# Altium project 6DOF_CONTROLLER.PrjPcb (part 1 of 2)
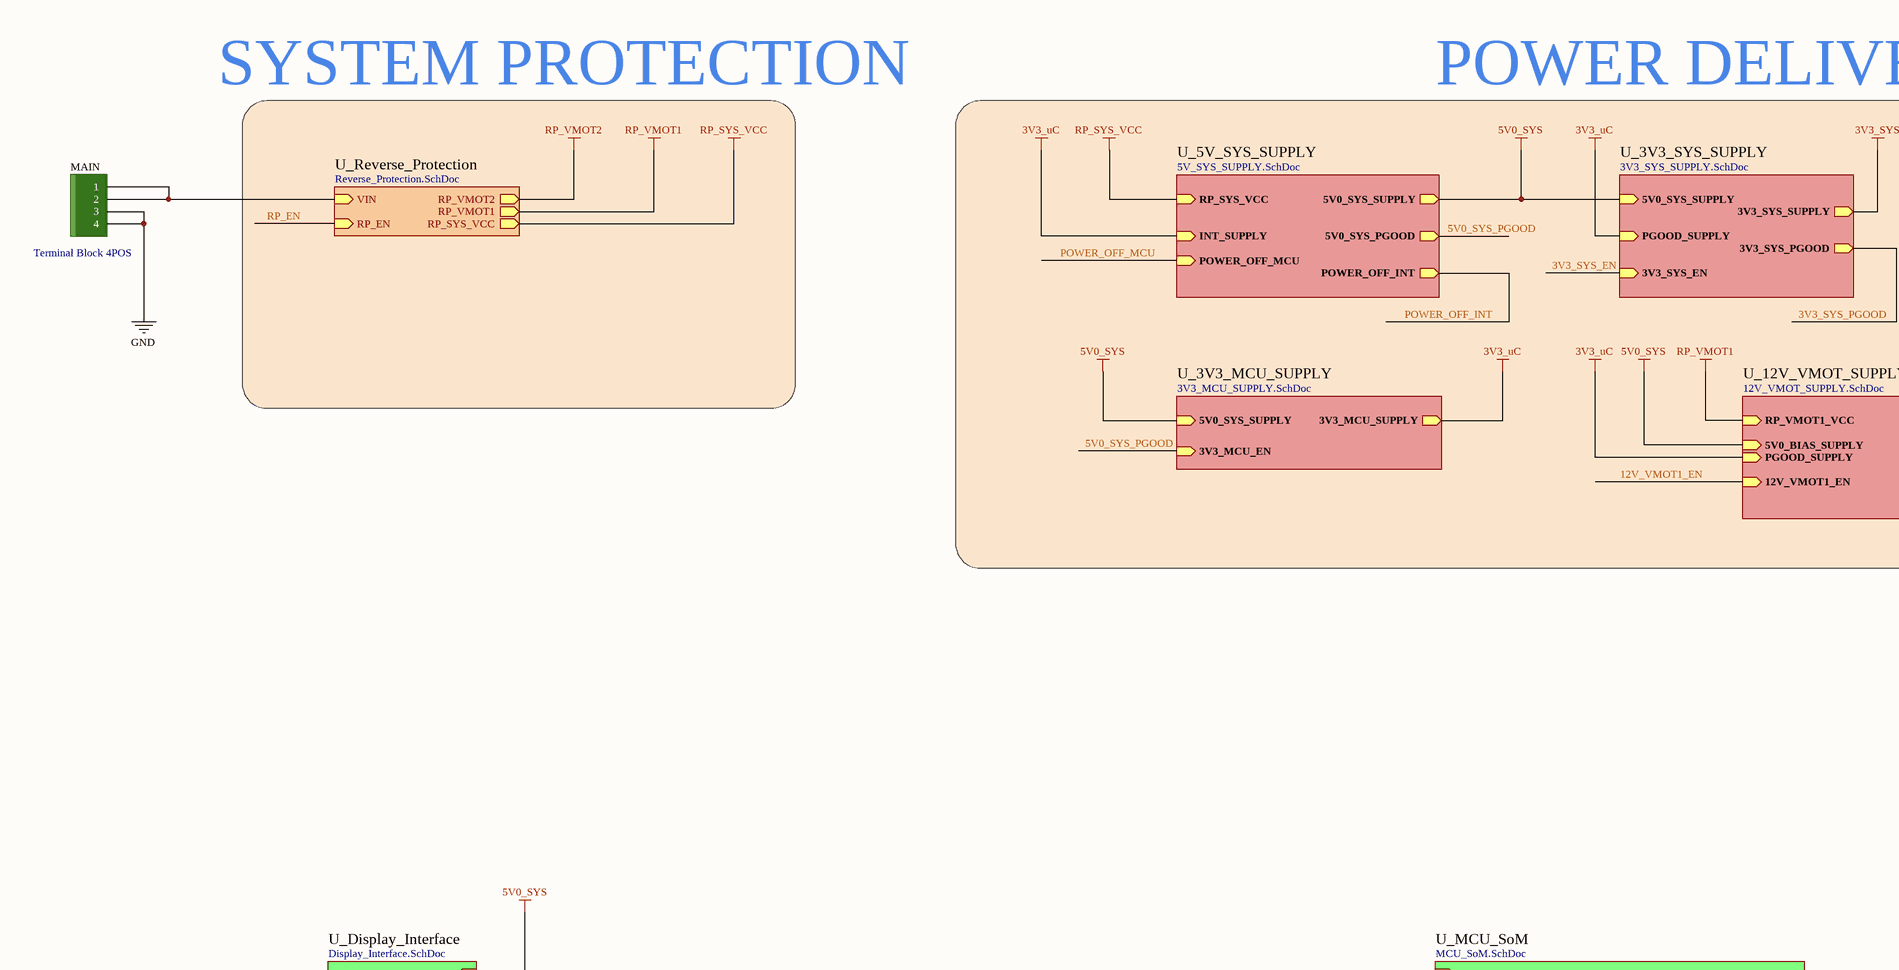
[diagram p0: 6DOF_CONTROLLER_Top.SchDoc, top left]
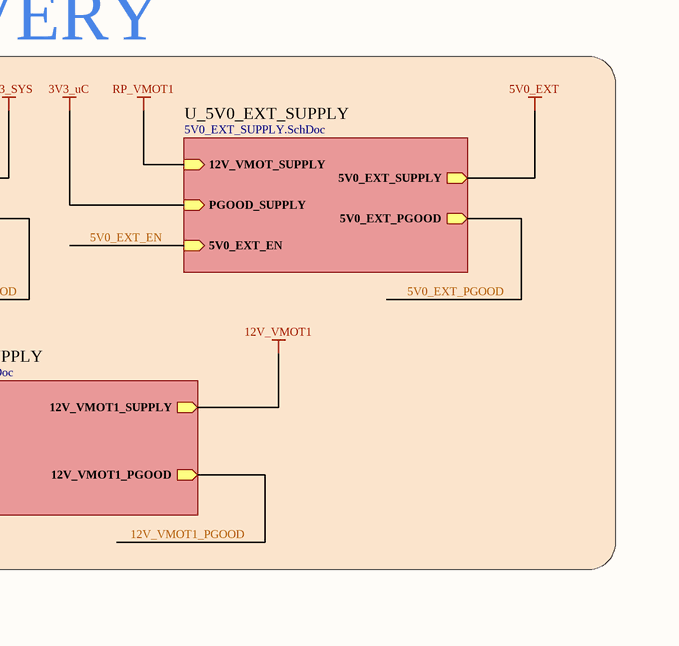
[diagram p1: 6DOF_CONTROLLER_Top.SchDoc, top right]
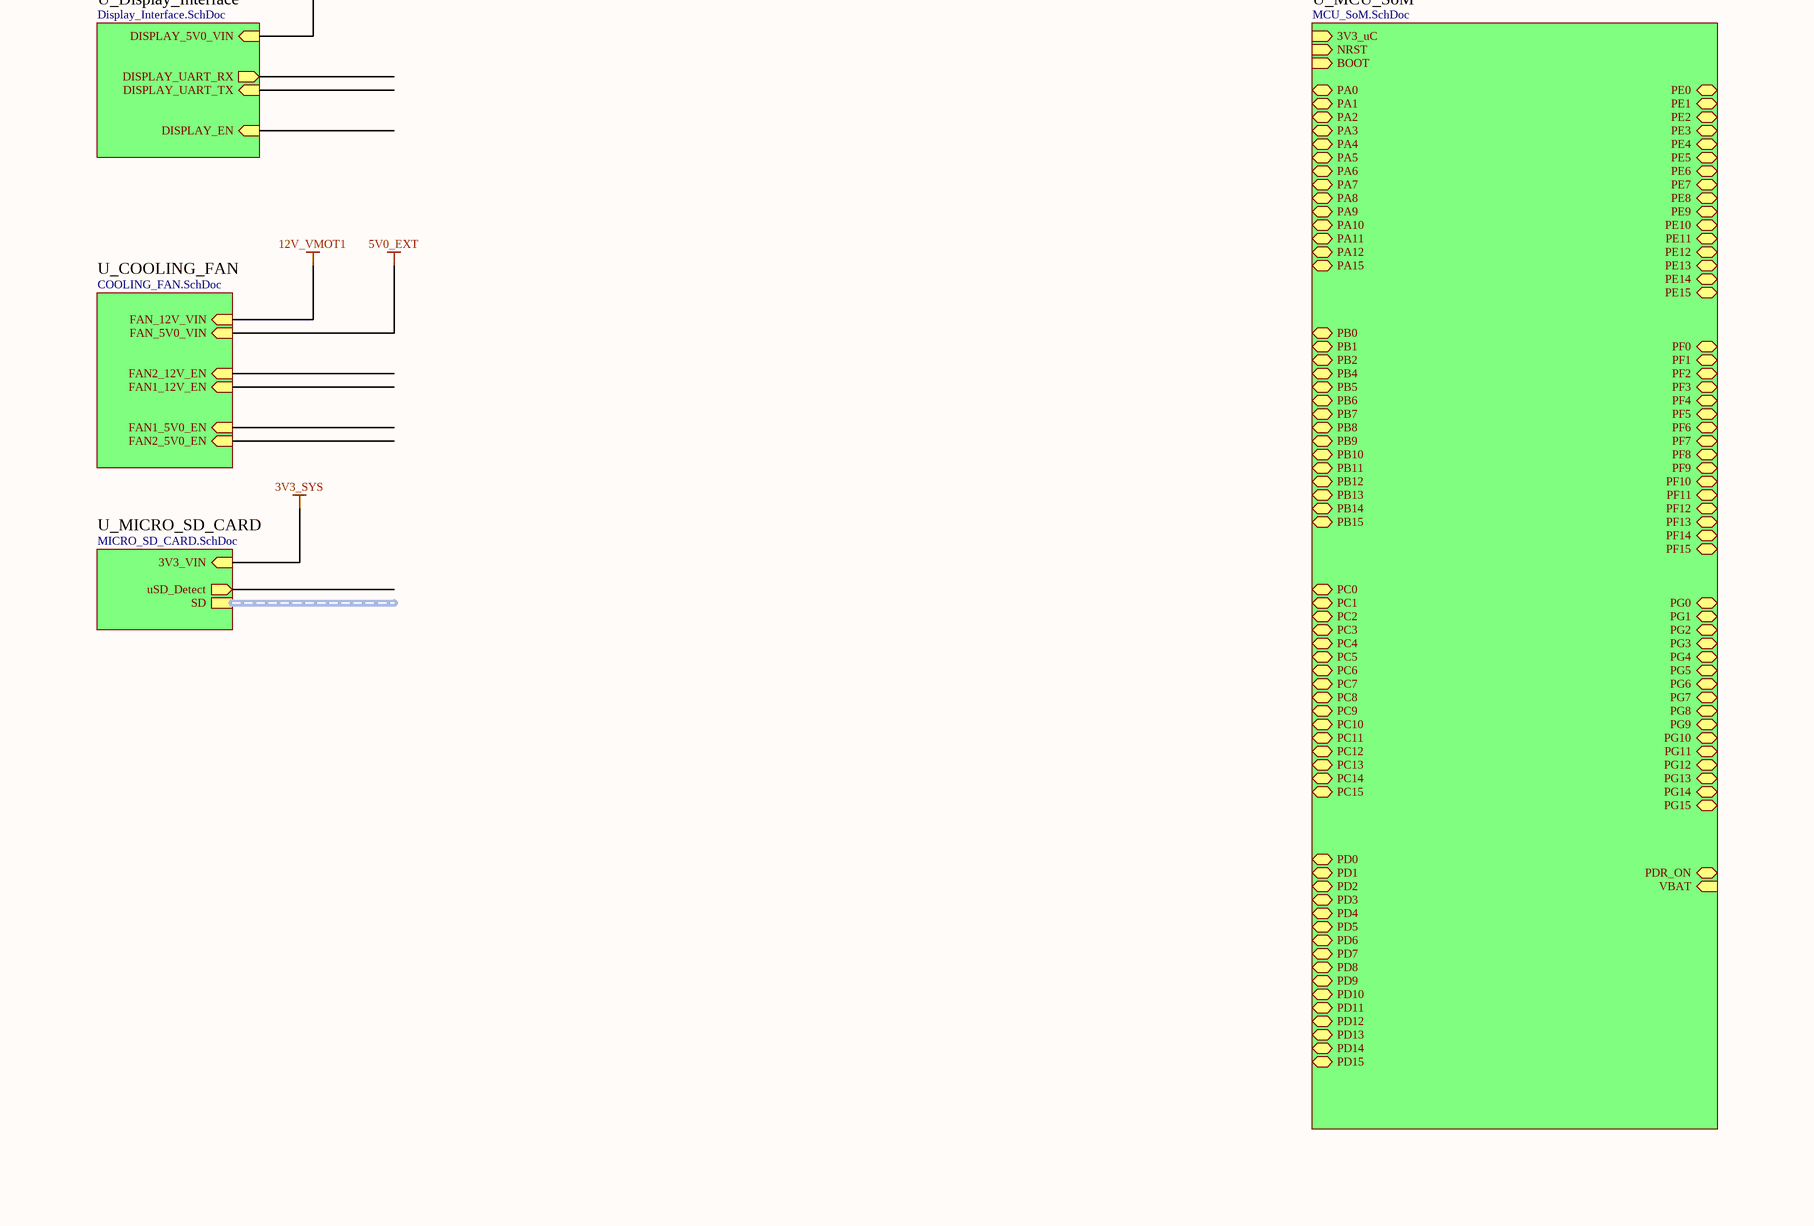
[diagram p2: 6DOF_CONTROLLER_Top.SchDoc, bottom left]
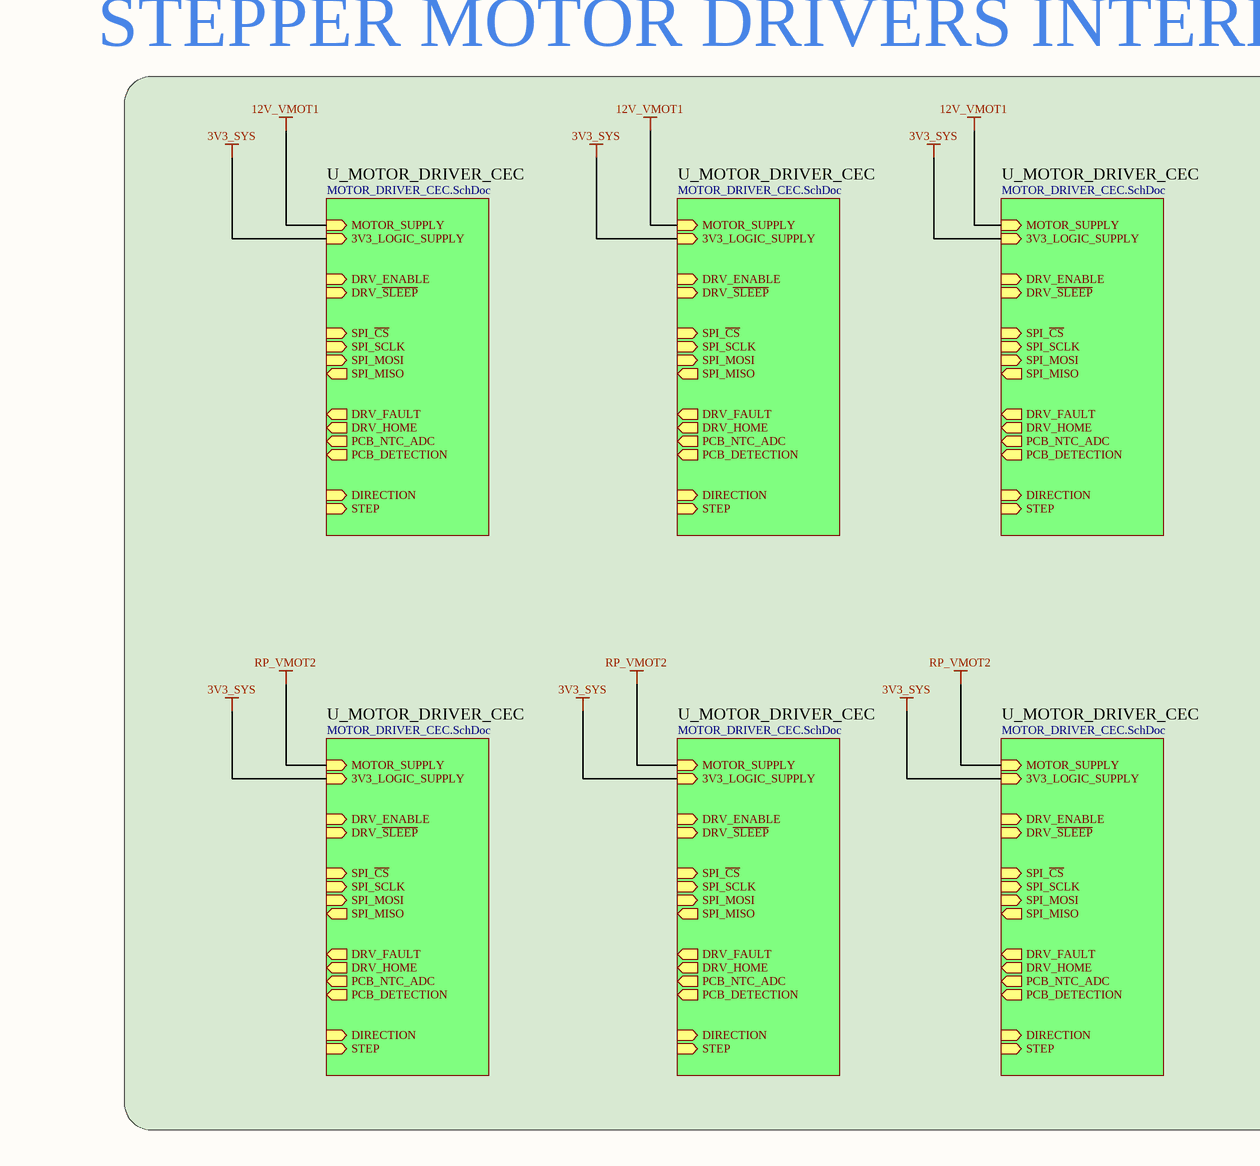
[diagram p3: 6DOF_CONTROLLER_Top.SchDoc, bottom right]
12 sheets, 465 parts. Net scope: hierarchical (ports join the sheet entries above them; power ports are global).
Board file: 6DOF_CONTROLLER.PcbDoc
Sheets:
  6DOF_CONTROLLER_Top.SchDoc
    U_Reverse_Protection = Reverse_Protection.SchDoc
    U_5V_SYS_SUPPLY = 5V_SYS_SUPPLY.SchDoc
    U_3V3_SYS_SUPPLY = 3V3_SYS_SUPPLY.SchDoc
    U_5V0_EXT_SUPPLY = 5V0_EXT_SUPPLY.SchDoc
    U_3V3_MCU_SUPPLY = 3V3_MCU_SUPPLY.SchDoc
    U_MOTOR_DRIVER_CEC = MOTOR_DRIVER_CEC.SchDoc
    U_MOTOR_DRIVER_CEC = MOTOR_DRIVER_CEC.SchDoc
    U_MOTOR_DRIVER_CEC = MOTOR_DRIVER_CEC.SchDoc
    U_MOTOR_DRIVER_CEC = MOTOR_DRIVER_CEC.SchDoc
    U_MOTOR_DRIVER_CEC = MOTOR_DRIVER_CEC.SchDoc
    U_MOTOR_DRIVER_CEC = MOTOR_DRIVER_CEC.SchDoc
    U_12V_VMOT_SUPPLY = 12V_VMOT_SUPPLY.SchDoc
    U_COOLING_FAN = COOLING_FAN.SchDoc
    U_Display_Interface = Display_Interface.SchDoc
    U_MICRO_SD_CARD = MICRO_SD_CARD.SchDoc
    U_MCU_SoM = MCU_SoM.SchDoc

## Sheet 6DOF_CONTROLLER_Top.SchDoc
size A1; SheetNumber: 1; SheetTotal: 12

### Parts
MAIN  Terminal Block 4POS  [TERM_BLOCK_5.08mm 4PIN]

### Sub-sheets
U_3V3_MCU_SUPPLY = 3V3_MCU_SUPPLY.SchDoc: 3V3_MCU_SUPPLY (out), 3V3_MCU_EN (in), 5V0_SYS_SUPPLY (in)
U_3V3_SYS_SUPPLY = 3V3_SYS_SUPPLY.SchDoc: 3V3_SYS_PGOOD (out), 3V3_SYS_EN (in), 5V0_SYS_SUPPLY (in), 3V3_SYS_SUPPLY (out), PGOOD_SUPPLY (in)
U_5V0_EXT_SUPPLY = 5V0_EXT_SUPPLY.SchDoc: 5V0_EXT_PGOOD (out), 5V0_EXT_EN (in), 12V_VMOT_SUPPLY (in), 5V0_EXT_SUPPLY (out), PGOOD_SUPPLY (in)
U_5V_SYS_SUPPLY = 5V_SYS_SUPPLY.SchDoc: 5V0_SYS_SUPPLY (out), 5V0_SYS_PGOOD (out), RP_SYS_VCC (in), POWER_OFF_INT (out), POWER_OFF_MCU (in), INT_SUPPLY (in)
U_12V_VMOT_SUPPLY = 12V_VMOT_SUPPLY.SchDoc: RP_VMOT1_VCC (in), PGOOD_SUPPLY (in), 12V_VMOT1_PGOOD (out), 5V0_BIAS_SUPPLY (in), 12V_VMOT1_EN (in), 12V_VMOT1_SUPPLY (out)
U_COOLING_FAN = COOLING_FAN.SchDoc: FAN_12V_VIN (in), FAN1_12V_EN (in), FAN2_12V_EN (in), FAN_5V0_VIN (in), FAN1_5V0_EN (in), FAN2_5V0_EN (in)
U_Display_Interface = Display_Interface.SchDoc: DISPLAY_5V0_VIN (in), DISPLAY_EN (in), DISPLAY_UART_TX (in), DISPLAY_UART_RX (out)
U_MCU_SoM = MCU_SoM.SchDoc: 3V3_uC (in), NRST (in), PE2 (bidir), PE3 (bidir), PE4 (bidir), PE5 (bidir), PE6 (bidir), PC13 (bidir), PC14 (bidir), PC15 (bidir), PC0 (bidir), PC1 (bidir), PC2 (bidir), PC3 (bidir), PC4 (bidir), PC5 (bidir), PB0 (bidir), PB1 (bidir), PB2 (bidir), PF11 (bidir), PF12 (bidir), PF13 (bidir), PF14 (bidir), PF15 (bidir), PB10 (bidir), PB11 (bidir), PE15 (bidir), VBAT (in), PF0 (bidir), PF1 (bidir), PF2 (bidir), PF3 (bidir), PF4 (bidir), PF5 (bidir), PF6 (bidir), PF7 (bidir), PF8 (bidir), PF9 (bidir), PF10 (bidir), PA0 (bidir), PA1 (bidir), PA2 (bidir), PA3 (bidir), PA4 (bidir), PA5 (bidir), PA6 (bidir), PA7 (bidir), PG0 (bidir), PG1 (bidir), PE7 (bidir), PE8 (bidir), PE9 (bidir), PE10 (bidir), PE11 (bidir), PE12 (bidir), PE13 (bidir), PE14 (bidir), PE1 (bidir), PE0 (bidir), PB9 (bidir), PB8 (bidir), BOOT (in), PB7 (bidir), PB6 (bidir), PB5 (bidir), PB4 (bidir), PC12 (bidir), PC11 (bidir), PC10 (bidir), PA15 (bidir), PA12 (bidir), PA11 (bidir), PA10 (bidir), PA9 (bidir), PA8 (bidir), PC9 (bidir), PC8 (bidir), PC7 (bidir), PC6 (bidir), PG8 (bidir), PG7 (bidir), PG6 (bidir), PG5 (bidir), PG4 (bidir), PG3 (bidir), PG2 (bidir), PDR_ON (bidir), PG15 (bidir), PG14 (bidir), PG13 (bidir), PG12 (bidir), PG11 (bidir), PG10 (bidir), PG9 (bidir), PD7 (bidir), PD6 (bidir), PD5 (bidir), PD4 (bidir), PD3 (bidir), PD2 (bidir), PD1 (bidir), PD0 (bidir), PD15 (bidir), PD14 (bidir), PD13 (bidir), PD12 (bidir), PD11 (bidir), PD10 (bidir), PD9 (bidir), PD8 (bidir), PB15 (bidir), PB14 (bidir), PB13 (bidir), PB12 (bidir)
U_MICRO_SD_CARD = MICRO_SD_CARD.SchDoc: SD (harness SD), 3V3_VIN (in), uSD_Detect (out)
U_MOTOR_DRIVER_CEC = MOTOR_DRIVER_CEC.SchDoc: SPI_~{CS} (in), SPI_MISO (out), SPI_MOSI (in), SPI_SCLK (in), DRV_ENABLE (in), DRV_~{SLEEP} (in), MOTOR_SUPPLY (in), 3V3_LOGIC_SUPPLY (in), STEP (in), DRV_FAULT (out), DRV_HOME (out), DIRECTION (in), PCB_NTC_ADC (out), PCB_DETECTION (out)
U_MOTOR_DRIVER_CEC = MOTOR_DRIVER_CEC.SchDoc: SPI_~{CS} (in), SPI_MISO (out), SPI_MOSI (in), SPI_SCLK (in), DRV_ENABLE (in), DRV_~{SLEEP} (in), MOTOR_SUPPLY (in), 3V3_LOGIC_SUPPLY (in), STEP (in), DRV_FAULT (out), DRV_HOME (out), DIRECTION (in), PCB_NTC_ADC (out), PCB_DETECTION (out)
U_MOTOR_DRIVER_CEC = MOTOR_DRIVER_CEC.SchDoc: SPI_~{CS} (in), SPI_MISO (out), SPI_MOSI (in), SPI_SCLK (in), DRV_ENABLE (in), DRV_~{SLEEP} (in), MOTOR_SUPPLY (in), 3V3_LOGIC_SUPPLY (in), STEP (in), DRV_FAULT (out), DRV_HOME (out), DIRECTION (in), PCB_NTC_ADC (out), PCB_DETECTION (out)
U_MOTOR_DRIVER_CEC = MOTOR_DRIVER_CEC.SchDoc: SPI_~{CS} (in), SPI_MISO (out), SPI_MOSI (in), SPI_SCLK (in), DRV_ENABLE (in), DRV_~{SLEEP} (in), MOTOR_SUPPLY (in), 3V3_LOGIC_SUPPLY (in), STEP (in), DRV_FAULT (out), DRV_HOME (out), DIRECTION (in), PCB_NTC_ADC (out), PCB_DETECTION (out)
U_MOTOR_DRIVER_CEC = MOTOR_DRIVER_CEC.SchDoc: SPI_~{CS} (in), SPI_MISO (out), SPI_MOSI (in), SPI_SCLK (in), DRV_ENABLE (in), DRV_~{SLEEP} (in), MOTOR_SUPPLY (in), 3V3_LOGIC_SUPPLY (in), STEP (in), DRV_FAULT (out), DRV_HOME (out), DIRECTION (in), PCB_NTC_ADC (out), PCB_DETECTION (out)
U_MOTOR_DRIVER_CEC = MOTOR_DRIVER_CEC.SchDoc: SPI_~{CS} (in), SPI_MISO (out), SPI_MOSI (in), SPI_SCLK (in), DRV_ENABLE (in), DRV_~{SLEEP} (in), MOTOR_SUPPLY (in), 3V3_LOGIC_SUPPLY (in), STEP (in), DRV_FAULT (out), DRV_HOME (out), DIRECTION (in), PCB_NTC_ADC (out), PCB_DETECTION (out)
U_Reverse_Protection = Reverse_Protection.SchDoc: VIN (in), RP_VMOT2 (out), RP_VMOT1 (out), RP_SYS_VCC (out), RP_EN (in)

### Nets
3V3_SYS: sheet U_3V3_SYS_SUPPLY/3V3_SYS_SUPPLY, sheet U_MOTOR_DRIVER_CEC/3V3_LOGIC_SUPPLY, sheet U_MOTOR_DRIVER_CEC/3V3_LOGIC_SUPPLY, sheet U_MOTOR_DRIVER_CEC/3V3_LOGIC_SUPPLY, sheet U_MOTOR_DRIVER_CEC/3V3_LOGIC_SUPPLY, sheet U_MOTOR_DRIVER_CEC/3V3_LOGIC_SUPPLY, sheet U_MOTOR_DRIVER_CEC/3V3_LOGIC_SUPPLY, sheet U_MICRO_SD_CARD/3V3_VIN
3V3_uC: sheet U_5V_SYS_SUPPLY/INT_SUPPLY, sheet U_3V3_SYS_SUPPLY/PGOOD_SUPPLY, sheet U_5V0_EXT_SUPPLY/PGOOD_SUPPLY, sheet U_3V3_MCU_SUPPLY/3V3_MCU_SUPPLY, sheet U_12V_VMOT_SUPPLY/PGOOD_SUPPLY
5V0_EXT: sheet U_5V0_EXT_SUPPLY/5V0_EXT_SUPPLY, sheet U_COOLING_FAN/FAN_5V0_VIN
5V0_SYS: sheet U_5V_SYS_SUPPLY/5V0_SYS_SUPPLY, sheet U_3V3_SYS_SUPPLY/5V0_SYS_SUPPLY, sheet U_3V3_MCU_SUPPLY/5V0_SYS_SUPPLY, sheet U_12V_VMOT_SUPPLY/5V0_BIAS_SUPPLY, sheet U_Display_Interface/DISPLAY_5V0_VIN
12V_VMOT1: sheet U_MOTOR_DRIVER_CEC/MOTOR_SUPPLY, sheet U_MOTOR_DRIVER_CEC/MOTOR_SUPPLY, sheet U_MOTOR_DRIVER_CEC/MOTOR_SUPPLY, sheet U_12V_VMOT_SUPPLY/12V_VMOT1_SUPPLY, sheet U_COOLING_FAN/FAN_12V_VIN
GND: MAIN.3 MAIN.4
RP_SYS_VCC: sheet U_Reverse_Protection/RP_SYS_VCC, sheet U_5V_SYS_SUPPLY/RP_SYS_VCC
RP_VMOT1: sheet U_Reverse_Protection/RP_VMOT1, sheet U_5V0_EXT_SUPPLY/12V_VMOT_SUPPLY, sheet U_12V_VMOT_SUPPLY/RP_VMOT1_VCC
RP_VMOT2: sheet U_Reverse_Protection/RP_VMOT2, sheet U_MOTOR_DRIVER_CEC/MOTOR_SUPPLY, sheet U_MOTOR_DRIVER_CEC/MOTOR_SUPPLY, sheet U_MOTOR_DRIVER_CEC/MOTOR_SUPPLY
5V0_SYS_PGOOD: sheet U_5V_SYS_SUPPLY/5V0_SYS_PGOOD, sheet U_3V3_MCU_SUPPLY/3V3_MCU_EN
NetC2000_2: MAIN.1 MAIN.2 ; sheet U_Reverse_Protection/VIN

### Notes on the sheet
- SYSTEM PROTECTION
- POWER DELIVERY
- STEPPER MOTOR DRIVERS INTERFACE

### Library data of the parts
MAIN = 00000011: XY2500R-D 250V 12A 5.08mm; ComponentLink1Description: Mikroprinc; ComponentLink1URL: https://www.mikroprinc.com/sr/proizvod/konektor-za-klemu-4-pol-pod-uglom-90-print-rm-508-xy2500

## Sheet Reverse_Protection.SchDoc
size A4; SheetNumber: 2; SheetTotal: 12
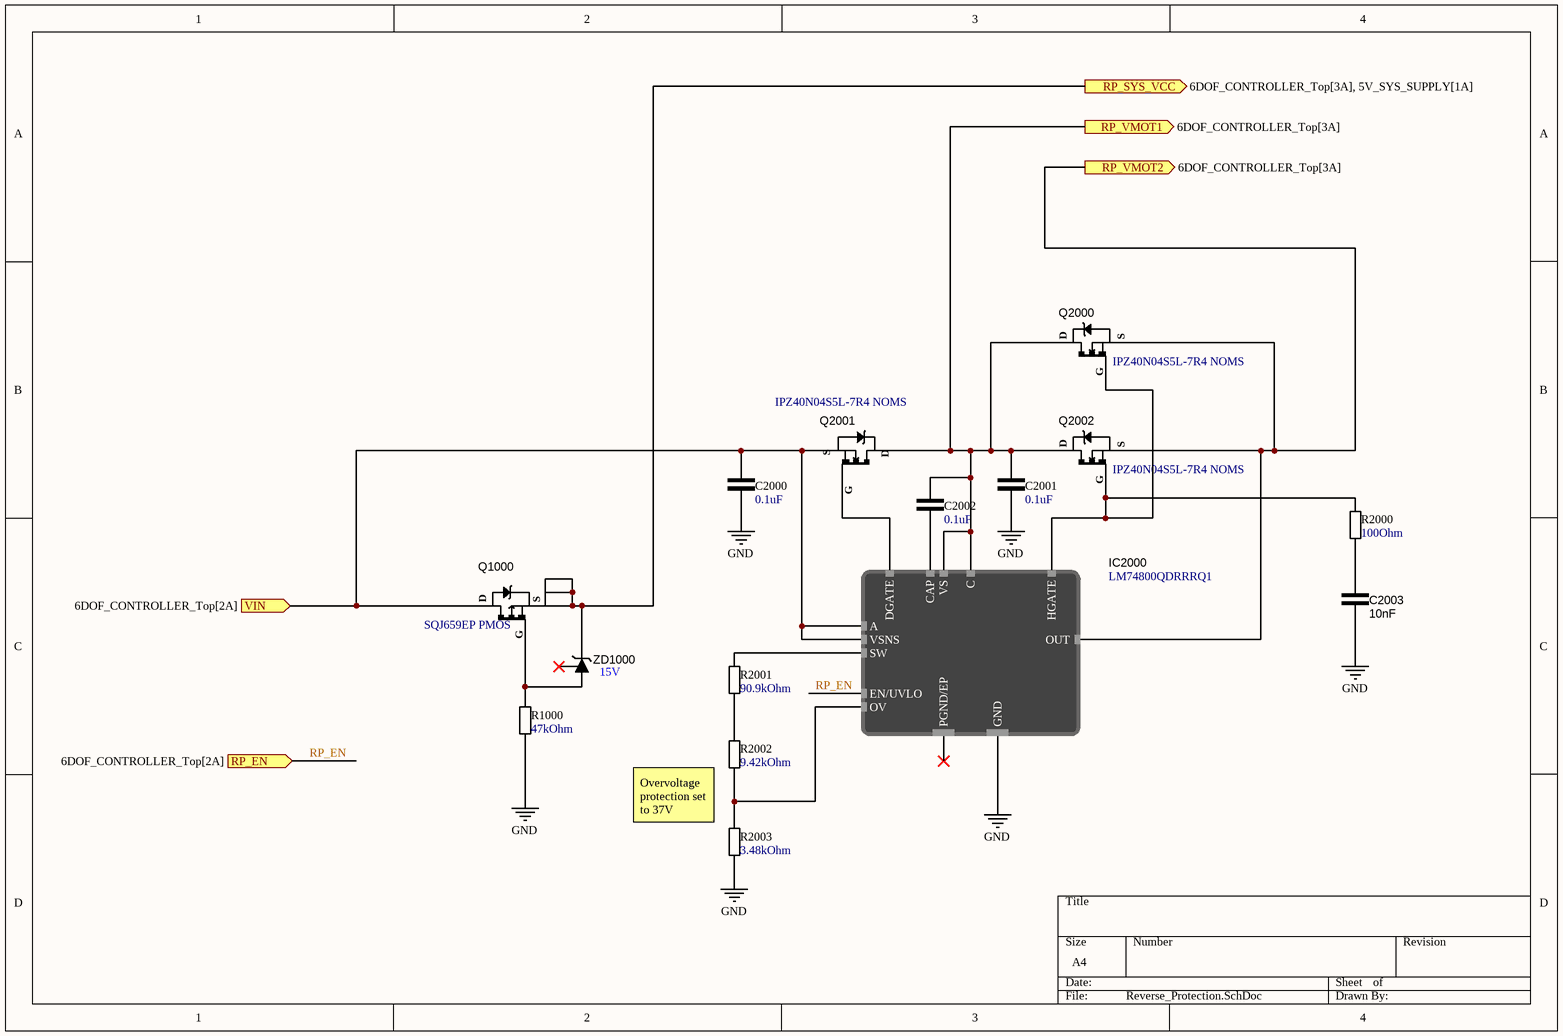
[diagram p4: Reverse_Protection.SchDoc]

### Parts
C2000  0.1uF  [CAP_0603]
C2001  0.1uF  [CAP_0603]
C2002  0.1uF  [CAP_0603]
C2003  10nF  [CAP_0603]
IC2000  LM74800QDRRRQ1  [SON50P300X80_HS-13N]
Q1000  SQJ659EP PMOS  [PowerPAK SO-8L SINGLE]
Q2000  IPZ40N04S5L-7R4 NOMS  [PG-TSDSON-8-32]
Q2001  IPZ40N04S5L-7R4 NOMS  [PG-TSDSON-8-32]
Q2002  IPZ40N04S5L-7R4 NOMS  [PG-TSDSON-8-32]
R1000  47kOhm  [RES_0603]
R2000  100Ohm  [RES_0603]
R2001  90.9kOhm  [RES_0603]
R2002  9.42kOhm  [RES_0603]
R2003  3.48kOhm  [RES_0603]
ZD1000  DZ23C15-E3-08 Zener Diode  [SOT95P245X96-3N]  (value not drawn)

### Ports
RP_EN (in, see 6DOF_CONTROLLER_Top[2A]), RP_SYS_VCC (out, see 6DOF_CONTROLLER_Top[3A], 5V_SYS_SUPPLY[1A]), RP_VMOT1 (out, see 6DOF_CONTROLLER_Top[3A]), RP_VMOT2 (out, see 6DOF_CONTROLLER_Top[3A]), VIN (in, see 6DOF_CONTROLLER_Top[2A])

### Nets
GND: C2000.1 C2001.1 C2003.1 IC2000.7(GND) R1000.1 R2003.1
RP_SYS_VCC: Q1000.S(S1) ZD1000.3(Cathode) ; port RP_SYS_VCC
RP_VMOT1: C2001.2 C2002.2 IC2000.10(VS) IC2000.12(C) Q2000.D(Drain) Q2001.D(Drain) Q2002.D(Drain) ; port RP_VMOT1
RP_VMOT2: IC2000.9(OUT) Q2000.S(Source) Q2002.S(Source) ; port RP_VMOT2
RP_EN: IC2000.6(EN/UVLO) ; port RP_EN
NetC2000_2: C2000.2 IC2000.2(A) IC2000.3(VSNS) Q1000.D Q2001.S(Source) ; port VIN
NetC2002_1: C2002.1 IC2000.11(CAP)
NetC2003_2: C2003.2 R2000.1
NetIC2000_1: IC2000.1(DGATE) Q2001.G(Gate)
NetIC2000_4: IC2000.4(SW) R2001.2
NetIC2000_5: IC2000.5(OV) R2002.1 R2003.2
NetIC2000_8: IC2000.8(HGATE) Q2000.G(Gate) Q2002.G(Gate) R2000.2
NetQ1000_G: Q1000.G R1000.2 ZD1000.1(Anode)
NetR2001_1: R2001.1 R2002.2

Not connected (* = marked no-connect by the designer): IC2000 13(PGND/EP)*; ZD1000 2(Anode)*

### Notes on the sheet
- (near ZD1000) 15V
- Overvoltage protection set to 37V

### Library data of the parts
C2000-C2002 = C000018: 0.1 µF ±10% 50V Ceramic Capacitor X7R 0603 (1608 Metric); ComponentLink1Description: DigiKey; ComponentLink1URL: https://www.digikey.com/en/products/detail/samsung-electro-mechanics/CL10B104KB8NNNC/3886658; DigiKey Part Number: 1276-1000-1-ND; capacitance: 0.1uF
C2003 = C000034: 10000 pF ±10% 50V Ceramic Capacitor X7R 0603 (1608 Metric); ComponentLink1Description: DigiKey; ComponentLink1URL: https://www.digikey.com/en/products/detail/kemet/C0603C103K5RACTU/411090; DigiKey Part Number: 399-C0603C103K5RACTUCT-ND; capacitance: 10nF
IC2000 = LM74800QDRRRQ1: OR Controller N+1 ORing Controller N-Channel 1:1 12-WSON (3x3); DigiKey Part Number: 296-LM74800QDRRRQ1CT-ND; ComponentLink1Description: DigiKey; ComponentLink1URL: https://www.digikey.com/en/products/detail/texas-instruments/LM74800QDRRRQ1/13627158; Mouser Part Number: 595-LM74800QDRRRQ1; ComponentLink2Description: Mouser; ComponentLink2URL: https://eu.mouser.com/ProductDetail/Texas-Instruments/LM74800QDRRRQ1?qs=KUoIvG%2F9IlYNgS7D9vQjYA%3D%3D
Q1000 = 00000005: P-Channel 60 V 52A (Tc) 83W (Tc) Surface Mount PowerPAK® SO-8; DigiKey Part Number: SQJ459EP-T1_GE3CT-ND; Mouser Part Number: 78-SQJ459EP-T2_BE3; ComponentLink1Description: DigiKey; ComponentLink1URL: https://www.digikey.com/en/products/detail/vishay-siliconix/SQJ459EP-T1-GE3/6708881; ComponentLink2Description: Mouser; ComponentLink2URL: https://eu.mouser.com/ProductDetail/Vishay-Siliconix/SQJ459EP-T2_BE3?qs=CiayqK2gdcKpg8h0vLRPjA%3D%3D
Q2000-Q2002 = 00000007: N-Channel 40 V 40A (Tc) 34W (Tc) Surface Mount PG-TSDSON-8; DigiKey Part Number: IPZ40N04S5L7R4ATMA1CT-ND; Mouser Part Number: 726-IPZ40N04S5L7R4AT; ComponentLink1Description: DigiKey; ComponentLink1URL: https://www.digikey.com/en/products/detail/infineon-technologies/IPZ40N04S5L7R4ATMA1/5960382; ComponentLink2Description: Mouser; ComponentLink2URL: https://eu.mouser.com/ProductDetail/Infineon-Technologies/IPZ40N04S5L7R4ATMA1?qs=RJIhqtkBntMJfptUOROQRQ%3D%3D; ComponentLink3Description: Footprint Drawing; ComponentLink3URL: https://www.infineon.com/cms/en/product/packages/PG-TSDSON/PG-TSDSON-8-32/#!downloads
R1000 = R000010: 47 kOhms ±1% 0.1W, 1/10W Chip Resistor 0603 (1608 Metric) Moisture Resistant Thick Film; ComponentLink1Description: DigiKey; ComponentLink1URL: https://www.digikey.com/en/products/detail/yageo/RC0603FR-0747KL/727253; resistance: 47kOhm; DigiKey Part Number: 311-47.0KHRCT-ND
R2000 = R000030: 100 Ohms ±1% 0.1W, 1/10W Chip Resistor 0603 (1608 Metric) Moisture Resistant Thick Film; ComponentLink1Description: DigiKey; ComponentLink1URL: https://www.digikey.com/en/products/detail/yageo/RC0603FR-07100RL/726888; resistance: 100Ohm; DigiKey Part Number: 311-100HRCT-ND
R2001 = R000027: 90.9 kOhms ±1% 0.1W, 1/10W Chip Resistor 0603 (1608 Metric) Automotive AEC-Q200 Thick Film; ComponentLink1Description: DigiKey; ComponentLink1URL: https://www.digikey.com/en/products/detail/panasonic-electronic-components/ERJ-3EKF9092V/196512; resistance: 90.9kOhm; DigiKey Part Number: P90.9KHCT-ND
R2002 = R000028: 9.42 kOhms ±1% 0.1W, 1/10W Chip Resistor 0603 (1608 Metric) Automotive AEC-Q200, Moisture Resistant Metal Film; ComponentLink1Description: DigiKey; ComponentLink1URL: https://www.digikey.com/en/products/detail/koa-speer-electronics-inc/RN73H1JTTD9421F25/10688584?s=N4IgjCBcoMxaBjKAzAhgGwM4FMA0IB7KAbXDBggF18AHAFyhAGU6AnASwDsBzEAX3xgAbPBBJIaLHkIkQMAJwAmACwjqIeoxYce-fIoAMADgCso8ZJz4ikUvIB0yxQAIA1gHkAFgFtMIdZqQIACqnOx07sgAstiomACurNh6IAC0iuZQbPHSNqRmlHwCIBm2IEmY7Jh0BKz%2BfEA; resistance: 9.42kOhm; DigiKey Part Number: 2019-RN73H1JTTD9421F25CT-ND
R2003 = R000029: 3.48 kOhms ±1% 0.1W, 1/10W Chip Resistor 0603 (1608 Metric) Automotive AEC-Q200 Thick Film; ComponentLink1Description: DigiKey; ComponentLink1URL: https://www.digikey.com/en/products/detail/stackpole-electronics-inc/RMCF0603FT3K48/1761028; resistance: 3.48kOhm; DigiKey Part Number: RMCF0603FT3K48CT-ND
ZD1000 = 00000006: Zener Diode Array 1 Pair Common Cathode 15 V 300 mW ±5% SOT-23-3; DigiKey Part Number: 112-DZ23C15-E3-08CT-ND; ComponentLink1Description: DigiKey; ComponentLink1URL: https://www.digikey.com/en/products/detail/vishay-general-semiconductor-diodes-division/DZ23C15-E3-08/4831460

## Sheet 5V_SYS_SUPPLY.SchDoc
size A3; SheetNumber: 3; SheetTotal: 12
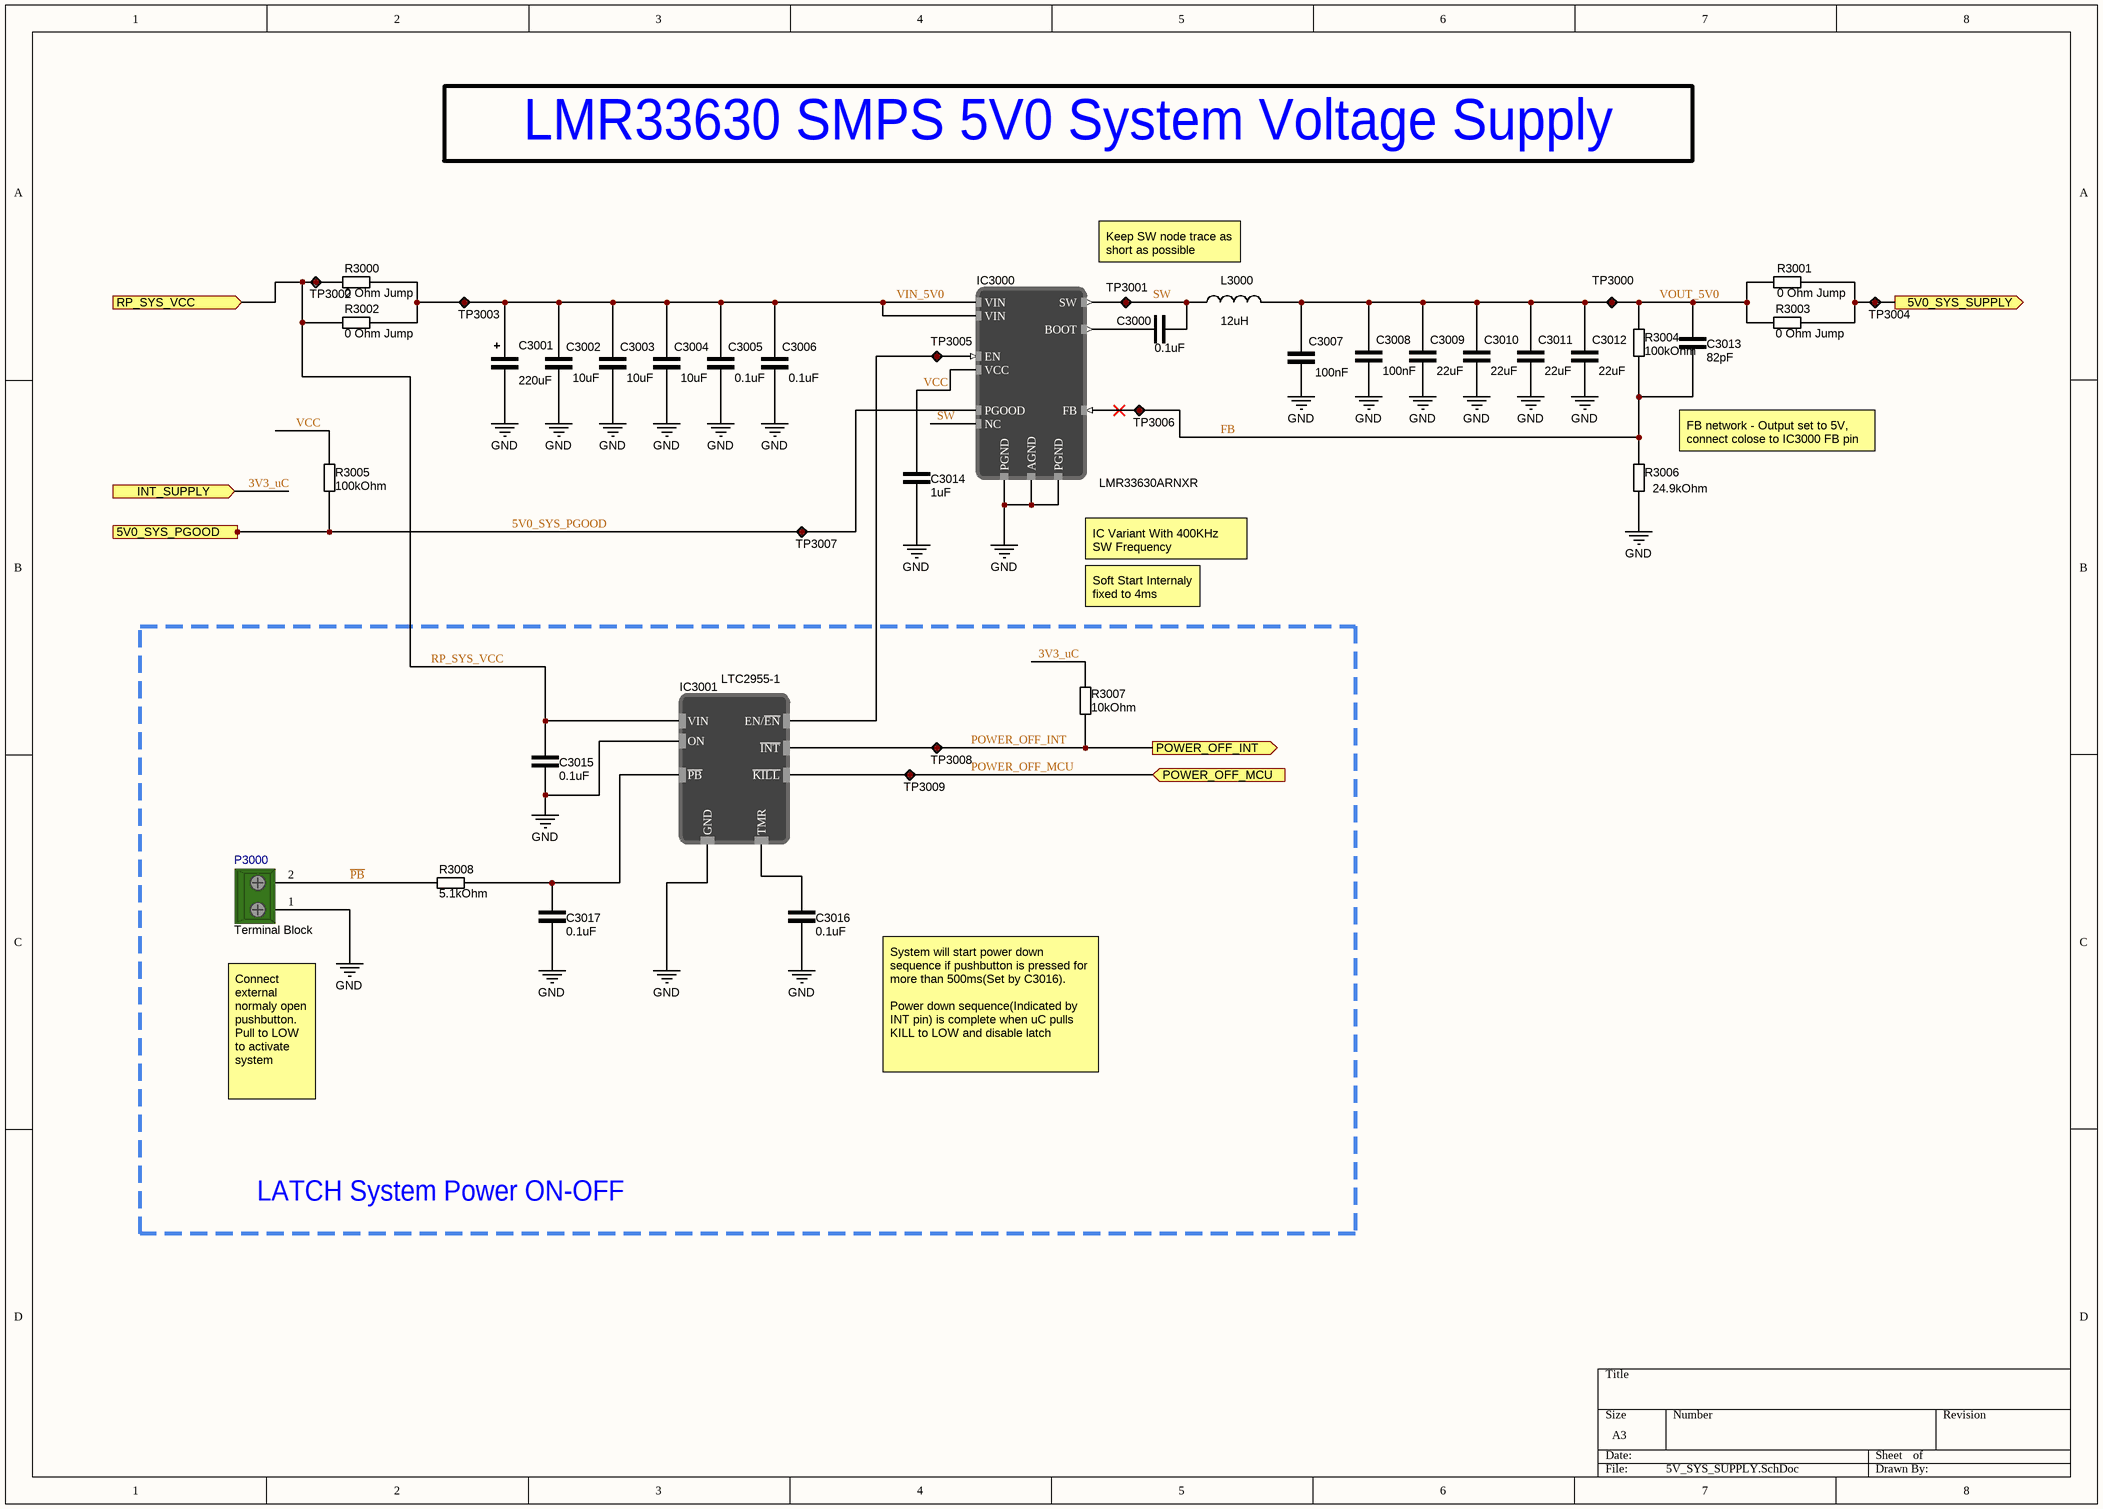
[diagram p5: 5V_SYS_SUPPLY.SchDoc]

### Parts
C3000  0.1uF  [CAP_0603]
C3001  220uF  [CAPAE109103X103M]
C3002  10uF  [CAP_1206]
C3003  10uF  [CAP_1206]
C3004  10uF  [CAP_1206]
C3005  0.1uF  [CAP_0603]
C3006  0.1uF  [CAP_0603]
C3007  100nF  [CAP_0603]
C3008  100nF  [CAP_0603]
C3009  22uF  [CAP_1206]
C3010  22uF  [CAP_1206]
C3011  22uF  [CAP_1206]
C3012  22uF  [CAP_1206]
C3013  82pF  [CAP_0603]
C3014  1uF  [CAP_0603]
C3015  0.1uF  [CAP_0603]
C3016  0.1uF  [CAP_0603]
C3017  0.1uF  [CAP_0603]
IC3000  LMR33630ARNXR  [VQFN-HR]
IC3001  LTC2955-1  [TSOP65P280X100-8N]
L3000  12uH  [INDM120120X80N]
P3000  Terminal Block  [TERM_BLOCK 5mm 2PIN]
R3000  0 Ohm Jump  [RES_0805]
R3001  0 Ohm Jump  [RES_1206]
R3002  0 Ohm Jump  [RES_0805]
R3003  0 Ohm Jump  [RES_1206]
R3004  100kOhm  [RES_0603]
R3005  100kOhm  [RES_0603]
R3006  24.9kOhm  [RES_0603]
R3007  10kOhm  [RES_0603]
R3008  5.1kOhm  [RES_0603]
TP3000  Test point  [TestPoint]  (value not drawn)
TP3001  Test point  [TestPoint]  (value not drawn)
TP3002  Test point  [TestPoint]  (value not drawn)
TP3003  Test point  [TestPoint]  (value not drawn)
TP3004  Test point  [TestPoint]  (value not drawn)
TP3005  Test point  [TestPoint]  (value not drawn)
TP3006  Test point  [TestPoint]  (value not drawn)
TP3007  Test point  [TestPoint]  (value not drawn)
TP3008  Test point  [TestPoint]  (value not drawn)
TP3009  Test point  [TestPoint]  (value not drawn)

### Ports
5V0_SYS_PGOOD (out, see 6DOF_CONTROLLER_Top[5A]), 5V0_SYS_SUPPLY (out, see 6DOF_CONTROLLER_Top[5A], 3V3_MCU_SUPPLY[1B], 3V3_SYS_SUPPLY[1B]), INT_SUPPLY (in, see 6DOF_CONTROLLER_Top[5A]), POWER_OFF_INT (out, see 6DOF_CONTROLLER_Top[5A]), POWER_OFF_MCU (in, see 6DOF_CONTROLLER_Top[5A]), RP_SYS_VCC (in, see 6DOF_CONTROLLER_Top[5A], Reverse_Protection[3A])

### Nets
3V3_uC: R3007.2 ; port INT_SUPPLY
5V0_SYS: R3001.1 R3003.2 TP3004.1 ; port 5V0_SYS_SUPPLY
GND: C3001.1 C3002.1 C3003.1 C3004.1 C3005.1 C3006.1 C3008.1 C3009.1 C3010.1 C3011.1 C3012.1 C3014.1 C3015.1 C3016.1 C3017.1 IC3000.1(PGND) IC3000.6(AGND) IC3000.11(PGND) IC3001.1(ON) IC3001.4(GND) P3000.1(pin1) R3006.1
RP_SYS_VCC: C3015.2 IC3001.6(VIN) R3000.1 R3002.1 TP3002.1 ; port RP_SYS_VCC
5V0_SYS_PGOOD: IC3000.8(PGOOD) R3005.1 TP3007.1 ; port 5V0_SYS_PGOOD
FB: C3013.1 IC3000.7(FB) R3004.1 R3006.2 TP3006.1  [project net FB_3]
~{PB}: P3000.2(pin2) R3008.1  [project net ~{PB}_3]
POWER_OFF_INT: IC3001.8(~{INT}) R3007.1 TP3008.1 ; port POWER_OFF_INT
POWER_OFF_MCU: IC3001.2(~{KILL}) TP3009.1 ; port POWER_OFF_MCU
SW: C3000.2 IC3000.3(NC) IC3000.12(SW) L3000.1 TP3001.1  [project net SW_3]
VCC: C3014.2 IC3000.5(VCC) R3005.2  [project net VCC_3]
VIN_5V0: C3001.2 C3002.2 C3003.2 C3004.2 C3005.2 C3006.2 IC3000.2(VIN) IC3000.10(VIN) R3000.2 R3002.2 TP3003.1  [project net VIN_5V0_3]
VOUT_5V0: C3007.2 C3008.2 C3009.2 C3010.2 C3011.2 C3012.2 C3013.2 L3000.2 R3001.2 R3003.1 R3004.2 TP3000.1  [project net VOUT_5V0_3]
NetC3000_1: C3000.1 IC3000.4(BOOT)
NetC3016_2: C3016.2 IC3001.3(TMR)
NetC3017_2: C3017.2 IC3001.5(~{PB}) R3008.2
NetIC3000_9: IC3000.9(EN) IC3001.7(EN/~{EN}) TP3005.1

Not connected (* = marked no-connect by the designer): C3007 1

### Notes on the sheet
- LMR33630 SMPS 5V0 System Voltage Supply
- Keep SW node trace as short as possible
- FB network - Output set to 5V, connect colose to IC3000 FB pin
- (near IC3000) IC Variant With 400KHz SW Frequency
- Soft Start Internaly fixed to 4ms
- Connect external normaly open pushbutton.
  Pull to LOW to activate system
- System will start power down sequence if pushbutton is pressed for more than 500ms(Set by C3016).
  Power down sequence(Indicated by INT pin) is complete when uC pulls KILL to LOW and disable latch
- LATCH System Power ON-OFF
- Labels drawn without touching a wire or pin: GND

### Library data of the parts
C3000 C3005 C3006 C3015-C3017 = C000018: as C2000 on sheet Reverse_Protection; ComponentLink1Description: DigiKey; ComponentLink1URL: https://www.digikey.com/en/products/detail/samsung-electro-mechanics/CL10B104KB8NNNC/3886658; DigiKey Part Number: 1276-1000-1-ND; capacitance: 0.1uF
C3001 = C000019: 220 µF 50 V Aluminum Electrolytic Capacitors Radial, Can - SMD 7000 Hrs @ 105°C; ComponentLink1Description: DigiKey; ComponentLink1URL: https://www.digikey.com/en/products/detail/nichicon/UCW1H221MNL1GS/2549783; DigiKey Part Number: 493-9426-1-ND; capacitance: 220uF
C3002-C3004 = C000017: 10 µF ±10% 50V Ceramic Capacitor X7R 1206 (3216 Metric); ComponentLink1Description: DigiKey; ComponentLink1URL: https://www.digikey.com/en/products/detail/samsung-electro-mechanics/CL31B106KBHNNNE/5961251; DigiKey Part Number: 1276-6767-1-ND; capacitance: 10uF
C3007 C3008 = C000007: 0.1 µF ±10% 25V Ceramic Capacitor X7R 0603 (1608 Metric); ComponentLink1Description: DigiKey; ComponentLink1URL: https://www.digikey.com/en/products/detail/kyocera-avx/06033C104K4T2A/8019250; DigiKey Part Number: 478-KAM15AR71E104KTCT-ND; capacitance: 100nF
C3009-C3012 = C000020: 22 µF ±10% 25V Ceramic Capacitor X5R 1206 (3216 Metric); ComponentLink1Description: DigiKey; ComponentLink1URL: https://www.digikey.com/en/products/detail/samsung-electro-mechanics/CL31A226KAHNNNE/3888705; DigiKey Part Number: 1276-3047-1-ND; capacitance: 22uF
C3013 = C000021: 82 pF ±1% 25V Ceramic Capacitor C0G, NP0 0603 (1608 Metric); ComponentLink1Description: DigiKey; ComponentLink1URL: https://www.digikey.com/en/products/detail/kyocera-avx/KGM15ACG1E820FT/1599315?s=N4IgjCBcoMxaBjKAzAhgGwM4FMA0IB7KAbXDBggF18AHAFyhAGU6AnASwDsBzEAX3xgALPBBJIaLHkIlwAVgCcAJiEB2ENRD1GLDj36CAbKPGSc%2BIpFIxlQ45u2RmbLrwEglABiEKTKDOYyViAAHEoABDQAYhq0DE4AqpzsdADyyACy2KiYAK6s2AYgALRKfpBsudKWpHIafA1AA; DigiKey Part Number: 478-KGM15ACG1E820FTCT-ND; capacitance: 82pF
C3014 = C000011: 1 µF ±10% 10V Ceramic Capacitor X7R 0603 (1608 Metric); ComponentLink1Description: DigiKey; ComponentLink1URL: https://www.digikey.com/en/products/detail/samsung-electro-mechanics/CL10B105KP8NNNC/3887604; DigiKey Part Number: 1276-1946-2-ND; capacitance: 1uF
IC3000 = LMR33630ARNXR: Buck Switching Regulator IC Positive Adjustable 1V 1 Output 3A 12-VFQFN; DigiKey Part Number: 296-49764-1-ND; ComponentLink1Description: DigiKey; ComponentLink1URL: https://www.digikey.com/en/products/detail/texas-instruments/LMR33630ARNXR/9356577; Mouser Part Number: 595-LMR33630ARNXR; ComponentLink2Description: Mouser; ComponentLink2URL: https://eu.mouser.com/ProductDetail/Texas-Instruments/LMR33630ARNXR?qs=55YtniHzbhBobt6bGtLStw%3D%3D
IC3001 = LTC2955-1: Power Supply Controller Push Button, On/Off Controller TSOT-23-8; DigiKey Part Number: 505-LTC2955CTS8-1#TRMPBFCT-ND; ComponentLink1Description: DigiKey; ComponentLink1URL: https://www.digikey.com/en/products/detail/analog-devices-inc/LTC2955CTS8-1-TRMPBF/3065178; Mouser Part Number: 584-C2955CTS8-1TMPF; ComponentLink2Description: Mouser; ComponentLink2URL: https://eu.mouser.com/ProductDetail/Analog-Devices/LTC2955CTS8-1TRMPBF?qs=hVkxg5c3xu%252B6Fq1Ir3bkGg%3D%3D
L3000 = L000007: FIXED IND 12UH 5.9A 24 MOHM SMD; inductance: 12uH; DigiKey Part Number: 732-1224-1-ND; ComponentLink1Description: DigiKey; ComponentLink1URL: https://www.digikey.com/en/products/detail/w%C3%BCrth-elektronik/744770112/1638629
P3000 = 00000001: Terminal block 90 deg 5mm 2PIN; ComponentLink1Description: DigiKey; ComponentLink1URL: https://www.digikey.com/en/products/detail/adam-tech/EB20-02-C/9831508; DigiKey part number: 2057-EB20-02-C-ND
R3000 R3002 = R000011: 0 Ohms Jumper Chip Resistor 0805 (2012 Metric) Automotive AEC-Q200 Thick Film; ComponentLink1Description: DigiKey; ComponentLink1URL: https://www.digikey.com/en/products/detail/panasonic-electronic-components/ERJ-6GEY0R00V/78163; resistance: 0 Ohm Jump; DigiKey Part Number: P0.0ACT-ND
R3001 R3003 = R000012: 0 Ohms Jumper Chip Resistor 1206 (3216 Metric) Automotive AEC-Q200 Thick Film; ComponentLink1Description: DigiKey; ComponentLink1URL: https://www.digikey.com/en/products/detail/stackpole-electronics-inc/RMCF1206ZT0R00/1756906; resistance: 0 Ohm Jump; DigiKey Part Number: RMCF1206ZT0R00CT-ND
R3004 R3005 = R000006: 100 kOhms ±1% 0.1W, 1/10W Chip Resistor 0603 (1608 Metric) Automotive AEC-Q200 Thick Film; resistance: 100kOhm; ComponentLink1Description: DigiKey; ComponentLink1URL: https://www.digikey.com/en/products/detail/stackpole-electronics-inc/RMCF0603FG100K/1713543; DigiKey Part Number: RMCF0603FG100KCT-ND
R3006 = R000017: 24.9 kOhms ±1% 0.1W, 1/10W Chip Resistor 0603 (1608 Metric) Automotive AEC-Q200 Thick Film; ComponentLink1Description: DigiKey; ComponentLink1URL: https://www.digikey.com/en/products/detail/panasonic-electronic-components/ERJ-3EKF2492V/196236; resistance: 24.9kOhm; DigiKey Part Number: P24.9KHCT-ND
R3007 = R000001: 10 kOhms ±1% 0.125W, 1/8W Chip Resistor 0603 (1608 Metric) Anti-Sulfur Thin Film; resistance: 10kOhm; ComponentLink1Description: DigiKey; ComponentLink1URL: https://www.digikey.com/en/products/detail/vishay-beyschlag-draloric-bc-components/MCT06030C1002FP500/1850440; DigiKey Part Number: MCT0603-10.0K-CFCT-ND
R3008 = R000013: 5.1 kOhms ±1% 0.1W, 1/10W Chip Resistor 0603 (1608 Metric) Moisture Resistant Thick Film; ComponentLink1Description: DigiKey; ComponentLink1URL: https://www.digikey.com/en/products/detail/yageo/RC0603FR-075K1L/727268; resistance: 5.1kOhm; DigiKey Part Number: 311-5.10KHRCT-ND
TP3000-TP3009 = TP002: Test point 1mm

## Sheet 3V3_SYS_SUPPLY.SchDoc
size A4; SheetNumber: 4; SheetTotal: 12
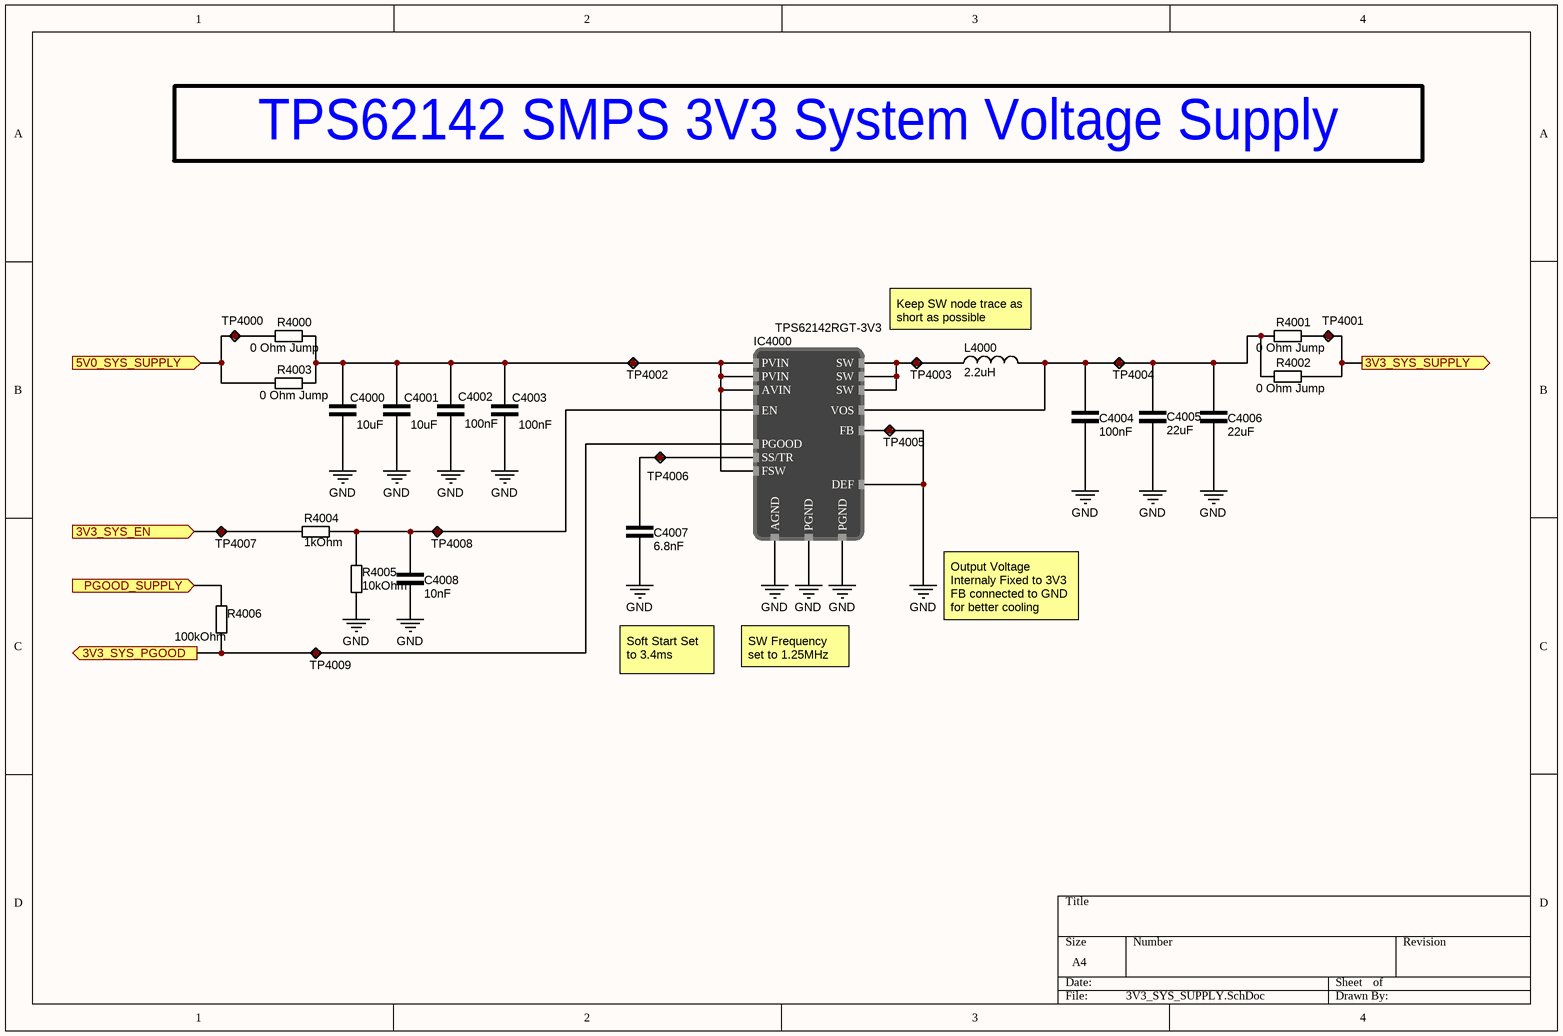
[diagram p6: 3V3_SYS_SUPPLY.SchDoc]

### Parts
C4000  10uF  [CAP_0805]
C4001  10uF  [CAP_0805]
C4002  100nF  [CAP_0603]
C4003  100nF  [CAP_0603]
C4004  100nF  [CAP_0603]
C4005  22uF  [CAP_0805]
C4006  22uF  [CAP_0805]
C4007  6.8nF  [CAP_0603]
C4008  10nF  [CAP_0603]
IC4000  TPS62142RGT-3V3  [QFN50P300X300X100_HS-17N]
L4000  2.2uH  [INDM4441X20N]
R4000  0 Ohm Jump  [RES_0805]
R4001  0 Ohm Jump  [RES_0805]
R4002  0 Ohm Jump  [RES_0805]
R4003  0 Ohm Jump  [RES_0805]
R4004  1kOhm  [RES_0603]
R4005  10kOhm  [RES_0603]
R4006  100kOhm  [RES_0603]
TP4000  Test point  [TestPoint]  (value not drawn)
TP4001  Test point  [TestPoint]  (value not drawn)
TP4002  Test point  [TestPoint]  (value not drawn)
TP4003  Test point  [TestPoint]  (value not drawn)
TP4004  Test point  [TestPoint]  (value not drawn)
TP4005  Test point  [TestPoint]  (value not drawn)
TP4006  Test point  [TestPoint]  (value not drawn)
TP4007  Test point  [TestPoint]  (value not drawn)
TP4008  Test point  [TestPoint]  (value not drawn)
TP4009  Test point  [TestPoint]  (value not drawn)

### Ports
3V3_SYS_EN (in, see 6DOF_CONTROLLER_Top[6A]), 3V3_SYS_PGOOD (out, see 6DOF_CONTROLLER_Top[7A]), 3V3_SYS_SUPPLY (out, see 6DOF_CONTROLLER_Top[7A]), 5V0_SYS_SUPPLY (in, see 6DOF_CONTROLLER_Top[6A], 3V3_MCU_SUPPLY[1B], 5V_SYS_SUPPLY[8A]), PGOOD_SUPPLY (in, see 6DOF_CONTROLLER_Top[6A], 5V0_EXT_SUPPLY[1C], 12V_VMOT_SUPPLY[6C])

### Nets
3V3_SYS: R4001.2 R4002.2 TP4001.1 ; port 3V3_SYS_SUPPLY
3V3_uC: R4006.2 ; port PGOOD_SUPPLY
5V0_SYS: R4000.1 R4003.1 TP4000.1 ; port 5V0_SYS_SUPPLY
GND: C4000.1 C4001.1 C4002.2 C4003.1 C4004.1 C4005.1 C4006.2 C4007.1 C4008.1 IC4000.5(FB) IC4000.6(AGND) IC4000.8(DEF) IC4000.15(PGND) IC4000.16(PGND) R4005.1 TP4005.1
3V3_SYS_EN: R4004.1 TP4007.1 ; port 3V3_SYS_EN
3V3_SYS_PGOOD: IC4000.4(PGOOD) R4006.1 TP4009.1 ; port 3V3_SYS_PGOOD
NetC4000_2: C4000.2 C4001.2 C4002.1 C4003.2 IC4000.7(FSW) IC4000.10(AVIN) IC4000.11(PVIN) IC4000.12(PVIN) R4000.2 R4003.2 TP4002.1
NetC4004_2: C4004.2 C4005.2 C4006.1 IC4000.14(VOS) L4000.2 R4001.1 R4002.1 TP4004.1
NetC4007_2: C4007.2 IC4000.9(SS/TR) TP4006.1
NetC4008_2: C4008.2 IC4000.13(EN) R4004.2 R4005.2 TP4008.1
NetIC4000_1: IC4000.1(SW) IC4000.2(SW) IC4000.3(SW) L4000.1 TP4003.1

### Notes on the sheet
- TPS62142 SMPS 3V3 System Voltage Supply
- Keep SW node trace as short as possible
- Output Voltage Internaly Fixed to 3V3
  FB connected to GND for better cooling
- Soft Start Set to 3.4ms
- SW Frequency set to 1.25MHz

### Library data of the parts
C4000 C4001 = C000002: 10 µF ±10% 25V Ceramic Capacitor X5R 0805 (2012 Metric); ComponentLink1Description: DigiKey; ComponentLink1URL: https://www.digikey.com/en/products/detail/tdk-corporation/C2012X5R1E106K125AB/2443462; DigiKey Part Number: 445-5984-1-ND; capacitance: 10uF
C4002-C4004 = C000007: as C3007 on sheet 5V_SYS_SUPPLY; ComponentLink1Description: DigiKey; ComponentLink1URL: https://www.digikey.com/en/products/detail/kyocera-avx/06033C104K4T2A/8019250; DigiKey Part Number: 478-KAM15AR71E104KTCT-ND; capacitance: 100nF
C4005 C4006 = C000001: 22 µF ±20% 25V Ceramic Capacitor X5R 0805 (2012 Metric); ComponentLink1Description: DigiKey; ComponentLink1URL: https://www.digikey.com/en/products/detail/tdk-corporation/C2012X5R1E226M125AC/3661564; DigiKey Part Number: 445-9112-1-ND; capacitance: 22uF
C4007 = C000023: 6800 pF ±10% 25V Ceramic Capacitor X7R 0603 (1608 Metric); ComponentLink1Description: DigiKey; ComponentLink1URL: https://www.digikey.com/en/products/detail/yageo/CC0603KRX7R8BB682/5883791; DigiKey Part Number: 311-4090-1-ND; capacitance: 6.8nF
C4008 = C000005: 10000 pF ±20% 25V Ceramic Capacitor X7R 0603 (1608 Metric); ComponentLink1Description: DigiKey; ComponentLink1URL: https://www.digikey.com/en/products/detail/kyocera-avx/06033C103MAT2A/1599370; DigiKey Part Number: 478-KGM15AR71E103MTCT-ND; capacitance: 10nF
IC4000 = TPS62142RGT: Buck Switching Regulator IC Positive Fixed 3.3V 1 Output 2A 16-VFQFN Exposed Pad; DigiKey Part Number: 296-29940-1-ND; Mouser Part Number: 595-TPS62142RGTT; ComponentLink1Description: DigiKey; ComponentLink1URL: https://www.digikey.com/en/products/detail/texas-instruments/TPS62142RGTT/2786730; ComponentLink2Description: Mouser; ComponentLink2URL: https://eu.mouser.com/ProductDetail/Texas-Instruments/TPS62142RGTT?qs=gXEV9p%2FxLgdBrEoz0pTJSA%3D%3D
L4000 = L000008: FIXED IND 2.2UH 4A 61 MOHM SMD; inductance: 2.2uH; DigiKey Part Number: SRP4020TA-2R2MCT-ND; ComponentLink1Description: DigiKey; ComponentLink1URL: https://www.digikey.com/en/products/detail/bourns-inc/SRP4020TA-2R2M/4901004?s=N4IgTCBcDaIMoCUAKAWADGNAVAggWjATAFkQBdAXyA
R4000-R4003 = R000011: as R3000 on sheet 5V_SYS_SUPPLY; ComponentLink1Description: DigiKey; ComponentLink1URL: https://www.digikey.com/en/products/detail/panasonic-electronic-components/ERJ-6GEY0R00V/78163; resistance: 0 Ohm Jump; DigiKey Part Number: P0.0ACT-ND
R4004 = R000004: 1 kOhms ±1% 0.125W, 1/8W Chip Resistor 0603 (1608 Metric) Anti-Sulfur Thin Film; resistance: 1kOhm; ComponentLink1Description: DigiKey; ComponentLink1URL: https://www.digikey.com/en/products/detail/vishay-beyschlag-draloric-bc-components/MCT06030C1001FP500/2607821; DigiKey Part Number: MCT0603-1.00K-CFCT-ND
R4005 = R000001: as R3007 on sheet 5V_SYS_SUPPLY; resistance: 10kOhm; ComponentLink1Description: DigiKey; ComponentLink1URL: https://www.digikey.com/en/products/detail/vishay-beyschlag-draloric-bc-components/MCT06030C1002FP500/1850440; DigiKey Part Number: MCT0603-10.0K-CFCT-ND
R4006 = R000006: as R3004 on sheet 5V_SYS_SUPPLY; resistance: 100kOhm; ComponentLink1Description: DigiKey; ComponentLink1URL: https://www.digikey.com/en/products/detail/stackpole-electronics-inc/RMCF0603FG100K/1713543; DigiKey Part Number: RMCF0603FG100KCT-ND
TP4000-TP4009 = TP002: Test point 1mm

## Sheet 5V0_EXT_SUPPLY.SchDoc
size A4; SheetNumber: 5; SheetTotal: 12
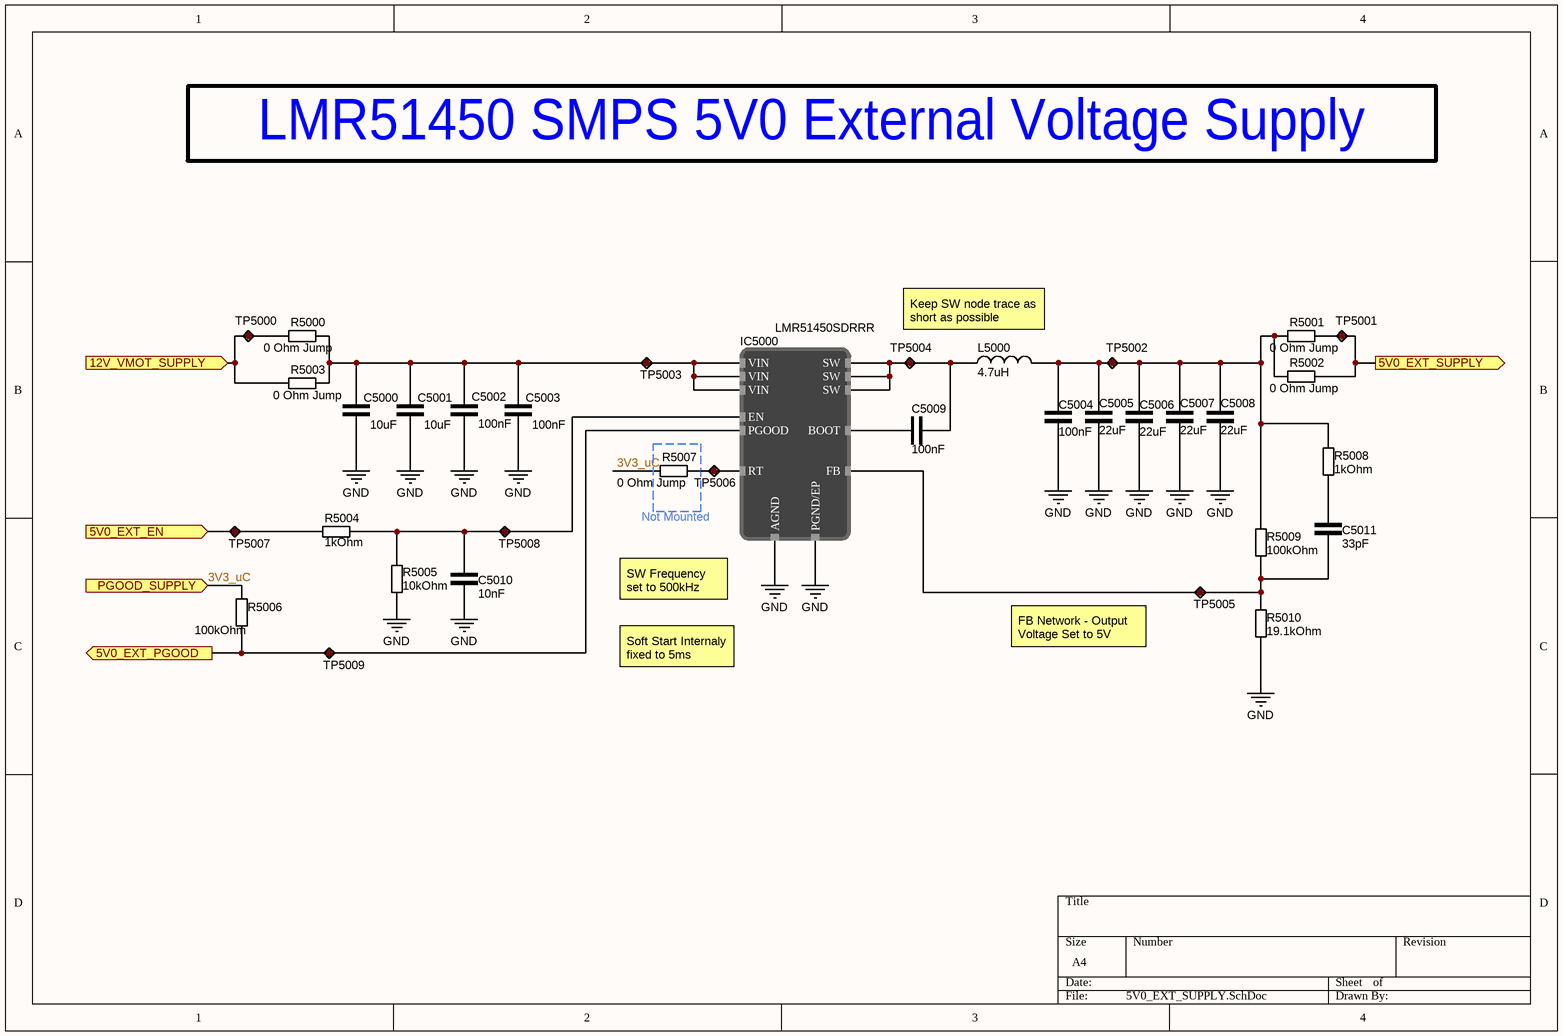
[diagram p7: 5V0_EXT_SUPPLY.SchDoc]

### Parts
C5000  10uF  [CAP_0805]
C5001  10uF  [CAP_0805]
C5002  100nF  [CAP_0603]
C5003  100nF  [CAP_0603]
C5004  100nF  [CAP_0603]
C5005  22uF  [CAP_0805]
C5006  22uF  [CAP_0805]
C5007  22uF  [CAP_0805]
C5008  22uF  [CAP_0805]
C5009  100nF  [CAP_0603]
C5010  10nF  [CAP_0603]
C5011  33pF  [CAP_0603]
IC5000  LMR51450SDRRR  [SON50P300X80_HS-13N]
L5000  4.7uH  [INDP6965X30N]
R5000  0 Ohm Jump  [RES_0805]
R5001  0 Ohm Jump  [RES_1206]
R5002  0 Ohm Jump  [RES_1206]
R5003  0 Ohm Jump  [RES_0805]
R5004  1kOhm  [RES_0603]
R5005  10kOhm  [RES_0603]
R5006  100kOhm  [RES_0603]
R5007  0 Ohm Jump  [RES_0603]
R5008  1kOhm  [RES_0603]
R5009  100kOhm  [RES_0603]
R5010  19.1kOhm  [RES_0603]
TP5000  Test point  [TestPoint]  (value not drawn)
TP5001  Test point  [TestPoint]  (value not drawn)
TP5002  Test point  [TestPoint]  (value not drawn)
TP5003  Test point  [TestPoint]  (value not drawn)
TP5004  Test point  [TestPoint]  (value not drawn)
TP5005  Test point  [TestPoint]  (value not drawn)
TP5006  Test point  [TestPoint]  (value not drawn)
TP5007  Test point  [TestPoint]  (value not drawn)
TP5008  Test point  [TestPoint]  (value not drawn)
TP5009  Test point  [TestPoint]  (value not drawn)

### Ports
5V0_EXT_EN (in, see 6DOF_CONTROLLER_Top[7A]), 5V0_EXT_PGOOD (out, see 6DOF_CONTROLLER_Top[8A]), 5V0_EXT_SUPPLY (out, see 6DOF_CONTROLLER_Top[8A]), 12V_VMOT_SUPPLY (in, see 6DOF_CONTROLLER_Top[7A]), PGOOD_SUPPLY (in, see 6DOF_CONTROLLER_Top[7A], 3V3_SYS_SUPPLY[1C], 12V_VMOT_SUPPLY[6C])

### Nets
3V3_uC: R5006.2 R5007.1 ; port PGOOD_SUPPLY
5V0_EXT: R5001.2 R5002.2 TP5001.1 ; port 5V0_EXT_SUPPLY
GND: C5000.1 C5001.1 C5002.2 C5003.1 C5004.1 C5005.1 C5006.2 C5007.1 C5008.1 C5010.1 IC5000.8(AGND) IC5000.13(PGND/EP) R5005.1 R5010.1
RP_VMOT1: R5000.1 R5003.1 TP5000.1 ; port 12V_VMOT_SUPPLY
5V0_EXT_EN: R5004.1 TP5007.1 ; port 5V0_EXT_EN
5V0_EXT_PGOOD: IC5000.5(PGOOD) R5006.1 TP5009.1 ; port 5V0_EXT_PGOOD
NetC5000_2: C5000.2 C5001.2 C5002.1 C5003.2 IC5000.10(VIN) IC5000.11(VIN) IC5000.12(VIN) R5000.2 R5003.2 TP5003.1
NetC5004_2: C5004.2 C5005.2 C5006.1 C5007.2 C5008.2 L5000.2 R5001.1 R5002.1 R5008.2 R5009.2 TP5002.1
NetC5009_1: C5009.1 IC5000.4(BOOT)
NetC5009_2: C5009.2 IC5000.1(SW) IC5000.2(SW) IC5000.3(SW) L5000.1 TP5004.1
NetC5010_2: C5010.2 IC5000.9(EN) R5004.2 R5005.2 TP5008.1
NetC5011_1: C5011.1 IC5000.7(FB) R5009.1 R5010.2 TP5005.1
NetC5011_2: C5011.2 R5008.1
NetIC5000_6: IC5000.6(RT) R5007.2 TP5006.1

### Notes on the sheet
- LMR51450 SMPS 5V0 External Voltage Supply
- Keep SW node trace as short as possible
- Not Mounted
- (near IC5000) SW Frequency set to 500kHz
- FB Network - Output Voltage Set to 5V
- Soft Start Internaly fixed to 5ms

### Library data of the parts
C5000 C5001 = C000002: as C4000 on sheet 3V3_SYS_SUPPLY; ComponentLink1Description: DigiKey; ComponentLink1URL: https://www.digikey.com/en/products/detail/tdk-corporation/C2012X5R1E106K125AB/2443462; DigiKey Part Number: 445-5984-1-ND; capacitance: 10uF
C5002-C5004 C5009 = C000007: as C3007 on sheet 5V_SYS_SUPPLY; ComponentLink1Description: DigiKey; ComponentLink1URL: https://www.digikey.com/en/products/detail/kyocera-avx/06033C104K4T2A/8019250; DigiKey Part Number: 478-KAM15AR71E104KTCT-ND; capacitance: 100nF
C5005-C5008 = C000001: as C4005 on sheet 3V3_SYS_SUPPLY; ComponentLink1Description: DigiKey; ComponentLink1URL: https://www.digikey.com/en/products/detail/tdk-corporation/C2012X5R1E226M125AC/3661564; DigiKey Part Number: 445-9112-1-ND; capacitance: 22uF
C5010 = C000005: as C4008 on sheet 3V3_SYS_SUPPLY; ComponentLink1Description: DigiKey; ComponentLink1URL: https://www.digikey.com/en/products/detail/kyocera-avx/06033C103MAT2A/1599370; DigiKey Part Number: 478-KGM15AR71E103MTCT-ND; capacitance: 10nF
C5011 = C000029: 33 pF ±5% 25V Ceramic Capacitor C0G, NP0 0603 (1608 Metric); ComponentLink1Description: DigiKey; ComponentLink1URL: https://www.digikey.com/en/products/detail/yageo/CC0603JRNPO8BN330/5883595; DigiKey Part Number: 311-3954-1-ND; capacitance: 33pF
IC5000 = LMR51450SDRRR: Buck Switching Regulator IC Positive Adjustable 0.8V 1 Output 5A 12-WFDFN Exposed Pad; DigiKey Part Number: 296-LMR51450SDRRRCT-ND; ComponentLink1Description: DigiKey; ComponentLink1URL: https://www.digikey.com/en/products/detail/texas-instruments/LMR51450SDRRR/17394946; Mouser Part Number: 595-LMR51450SDRRR; ComponentLink2Description: Mouser; ComponentLink2URL: https://eu.mouser.com/ProductDetail/Texas-Instruments/LMR51450SDRRR?qs=rQFj71Wb1eUvKinsjoLiUA%3D%3D
L5000 = L000011: FIXED IND 4.7UH 5.5A 40 MOHM SMD; inductance: 4.7uH; DigiKey Part Number: 541-1010-1-ND; ComponentLink1Description: DigiKey; ComponentLink1URL: https://www.digikey.com/en/products/detail/vishay-dale/IHLP2525CZER4R7M01/1220675
R5000 R5003 = R000011: as R3000 on sheet 5V_SYS_SUPPLY; ComponentLink1Description: DigiKey; ComponentLink1URL: https://www.digikey.com/en/products/detail/panasonic-electronic-components/ERJ-6GEY0R00V/78163; resistance: 0 Ohm Jump; DigiKey Part Number: P0.0ACT-ND
R5001 R5002 = R000012: as R3001 on sheet 5V_SYS_SUPPLY; ComponentLink1Description: DigiKey; ComponentLink1URL: https://www.digikey.com/en/products/detail/stackpole-electronics-inc/RMCF1206ZT0R00/1756906; resistance: 0 Ohm Jump; DigiKey Part Number: RMCF1206ZT0R00CT-ND
R5004 R5008 = R000004: as R4004 on sheet 3V3_SYS_SUPPLY; resistance: 1kOhm; ComponentLink1Description: DigiKey; ComponentLink1URL: https://www.digikey.com/en/products/detail/vishay-beyschlag-draloric-bc-components/MCT06030C1001FP500/2607821; DigiKey Part Number: MCT0603-1.00K-CFCT-ND
R5005 = R000001: as R3007 on sheet 5V_SYS_SUPPLY; resistance: 10kOhm; ComponentLink1Description: DigiKey; ComponentLink1URL: https://www.digikey.com/en/products/detail/vishay-beyschlag-draloric-bc-components/MCT06030C1002FP500/1850440; DigiKey Part Number: MCT0603-10.0K-CFCT-ND
R5006 R5009 = R000006: as R3004 on sheet 5V_SYS_SUPPLY; resistance: 100kOhm; ComponentLink1Description: DigiKey; ComponentLink1URL: https://www.digikey.com/en/products/detail/stackpole-electronics-inc/RMCF0603FG100K/1713543; DigiKey Part Number: RMCF0603FG100KCT-ND
R5007 = R000007: 0 Ohms Jumper Chip Resistor 0603 (1608 Metric) Automotive AEC-Q200 Thick Film; ComponentLink1Description: DigiKey; ComponentLink1URL: https://www.digikey.com/en/products/detail/stackpole-electronics-inc/RMCF0603ZT0R00/1756908; resistance: 0 Ohm Jump; DigiKey Part Number: RMCF0603ZT0R00CT-ND
R5010 = R000020: 19.1 kOhms ±1% 0.1W, 1/10W Chip Resistor 0603 (1608 Metric) Moisture Resistant Thick Film; ComponentLink1Description: DigiKey; ComponentLink1URL: https://www.digikey.com/en/products/detail/yageo/RC0603FR-0719K1L/727001; resistance: 19.1kOhm; DigiKey Part Number: 311-19.1KHRCT-ND
TP5000-TP5009 = TP002: Test point 1mm

## Sheet 3V3_MCU_SUPPLY.SchDoc
size A4; SheetNumber: 6; SheetTotal: 12
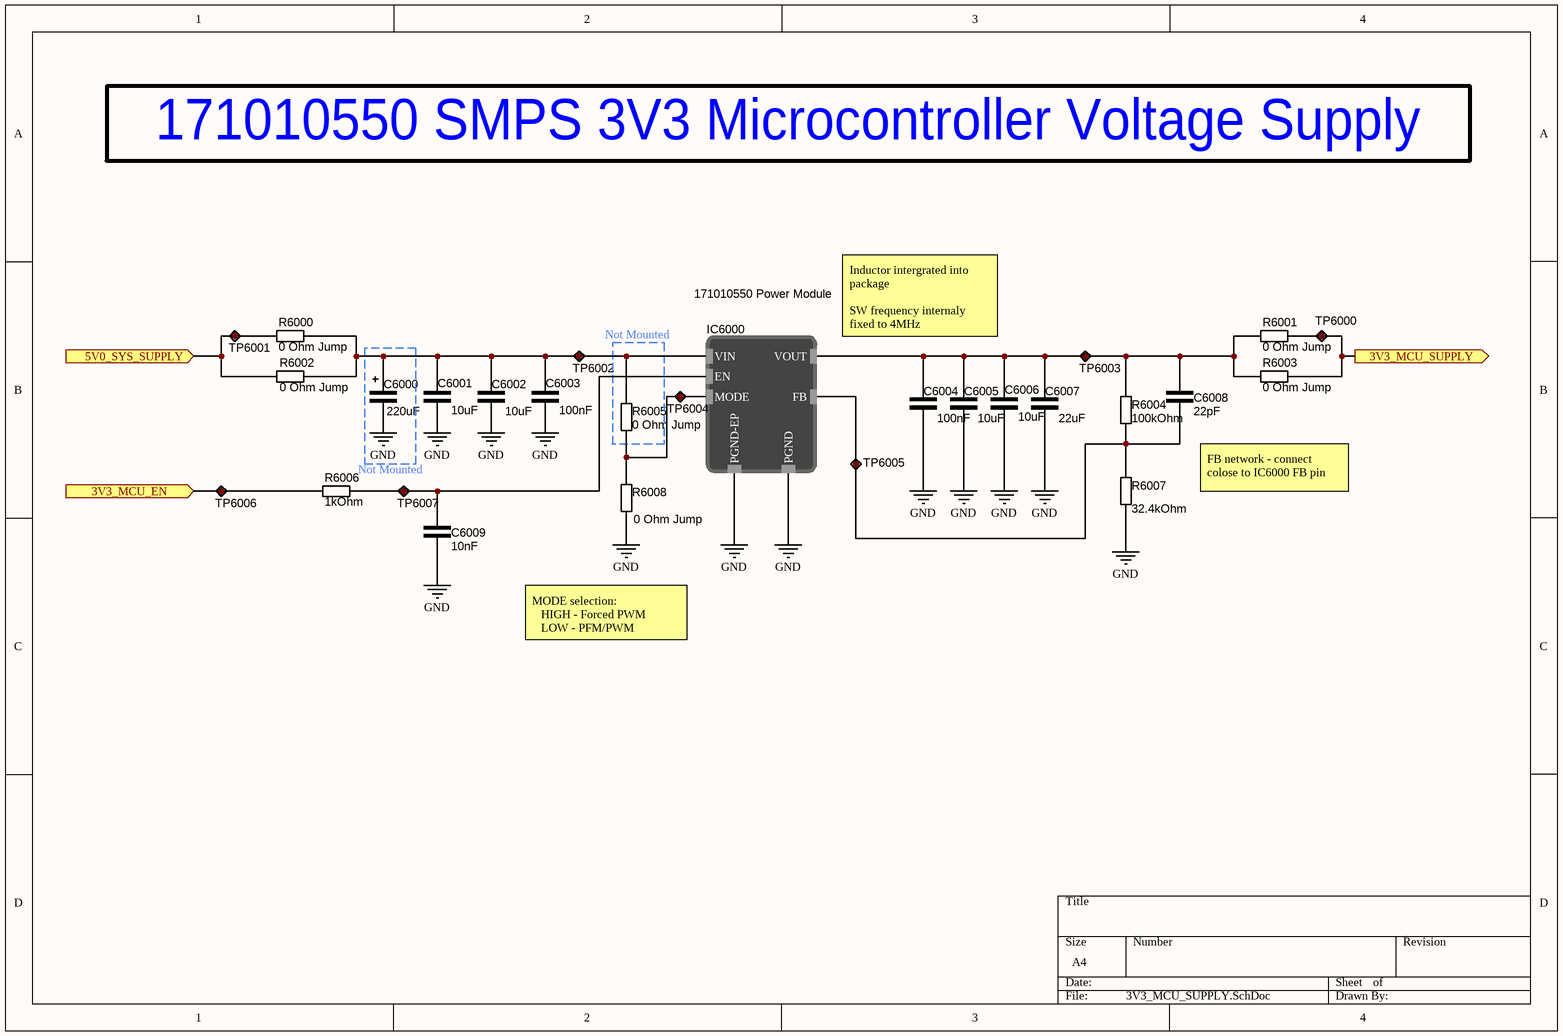
[diagram p8: 3V3_MCU_SUPPLY.SchDoc]

### Parts
C6000  220uF  [CAPAE9083X100M]
C6001  10uF  [CAP_0805]
C6002  10uF  [CAP_0805]
C6003  100nF  [CAP_0603]
C6004  100nF  [CAP_0603]
C6005  10uF  [CAP_0805]
C6006  10uF  [CAP_0805]
C6007  22uF  [CAP_0805]
C6008  22pF  [CAP_0603]
C6009  10nF  [CAP_0603]
IC6000  171010550 Power Module  [171010550]
R6000  0 Ohm Jump  [RES_0603]
R6001  0 Ohm Jump  [RES_0805]
R6002  0 Ohm Jump  [RES_0603]
R6003  0 Ohm Jump  [RES_0805]
R6004  100kOhm  [RES_0603]
R6005  0 Ohm Jump  [RES_0603]
R6006  1kOhm  [RES_0603]
R6007  32.4kOhm  [RES_0603]
R6008  0 Ohm Jump  [RES_0603]
TP6000  Test point  [TestPoint]  (value not drawn)
TP6001  Test point  [TestPoint]  (value not drawn)
TP6002  Test point  [TestPoint]  (value not drawn)
TP6003  Test point  [TestPoint]  (value not drawn)
TP6004  Test point  [TestPoint]  (value not drawn)
TP6005  Test point  [TestPoint]  (value not drawn)
TP6006  Test point  [TestPoint]  (value not drawn)
TP6007  Test point  [TestPoint]  (value not drawn)

### Ports
3V3_MCU_EN (in, see 6DOF_CONTROLLER_Top[5A]), 3V3_MCU_SUPPLY (out, see 6DOF_CONTROLLER_Top[5A]), 5V0_SYS_SUPPLY (in, see 6DOF_CONTROLLER_Top[5A], 3V3_SYS_SUPPLY[1B], 5V_SYS_SUPPLY[8A])

### Nets
3V3_uC: R6001.2 R6003.2 TP6000.1 ; port 3V3_MCU_SUPPLY
5V0_SYS: R6000.1 R6002.2 TP6001.1 ; port 5V0_SYS_SUPPLY
GND: C6004.1 C6005.1 C6006.2 C6007.2 C6009.1 IC6000.5(PGND) IC6000.EP(PGND-EP) R6007.1 R6008.1
5V0_SYS_PGOOD: R6006.1 TP6006.1 ; port 3V3_MCU_EN
NetC6000_2: C6000.2 C6001.1 C6002.2 C6003.1 IC6000.4(VIN) R6000.2 R6002.1 R6005.2 TP6002.1
NetC6004_2: C6004.2 C6005.2 C6006.1 C6007.1 C6008.2 IC6000.6(VOUT) R6001.1 R6003.1 R6004.2 TP6003.1
NetC6008_1: C6008.1 IC6000.1(FB) R6004.1 R6007.2 TP6005.1
NetC6009_2: C6009.2 IC6000.3(EN) R6006.2 TP6007.1
NetIC6000_2: IC6000.2(MODE) R6005.1 R6008.2 TP6004.1

Not connected (* = marked no-connect by the designer): C6000 1; C6001 2; C6002 1; C6003 2

### Notes on the sheet
- 171010550 SMPS 3V3 Microcontroller Voltage Supply
- Not Mounted
- (near IC6000) Inductor intergrated into package
  SW frequency internaly fixed to 4MHz
- FB network - connect colose to IC6000 FB pin
- MODE selection:
  HIGH - Forced PWM
  LOW - PFM/PWM
- Labels drawn without touching a wire or pin: GND

### Library data of the parts
C6000 = C000025: 220 µF 10 V Aluminum - Polymer Capacitors Radial, Can - SMD 20mOhm 2000 Hrs @ 105°C; ComponentLink1Description: DigiKey; ComponentLink1URL: https://www.digikey.com/en/products/detail/kemet/A765KN227M1ALAE020/6196558; DigiKey Part Number: 399-A765KN227M1ALAE020CT-ND; capacitance: 220uF
C6001 C6002 C6005 C6006 = C000002: as C4000 on sheet 3V3_SYS_SUPPLY; ComponentLink1Description: DigiKey; ComponentLink1URL: https://www.digikey.com/en/products/detail/tdk-corporation/C2012X5R1E106K125AB/2443462; DigiKey Part Number: 445-5984-1-ND; capacitance: 10uF
C6003 C6004 = C000007: as C3007 on sheet 5V_SYS_SUPPLY; ComponentLink1Description: DigiKey; ComponentLink1URL: https://www.digikey.com/en/products/detail/kyocera-avx/06033C104K4T2A/8019250; DigiKey Part Number: 478-KAM15AR71E104KTCT-ND; capacitance: 100nF
C6007 = C000001: as C4005 on sheet 3V3_SYS_SUPPLY; ComponentLink1Description: DigiKey; ComponentLink1URL: https://www.digikey.com/en/products/detail/tdk-corporation/C2012X5R1E226M125AC/3661564; DigiKey Part Number: 445-9112-1-ND; capacitance: 22uF
C6008 = C000024: 22 pF ±10% 25V Ceramic Capacitor X7R 0603 (1608 Metric); ComponentLink1Description: DigiKey; ComponentLink1URL: https://www.digikey.com/en/products/detail/kemet/C0603C220K3RACAUTO/16524857; DigiKey Part Number: 399-C0603C220K3RACAUTOCT-ND; capacitance: 22pF
C6009 = C000005: as C4008 on sheet 3V3_SYS_SUPPLY; ComponentLink1Description: DigiKey; ComponentLink1URL: https://www.digikey.com/en/products/detail/kyocera-avx/06033C103MAT2A/1599370; DigiKey Part Number: 478-KGM15AR71E103MTCT-ND; capacitance: 10nF
IC6000 = 171010550: Non-Isolated PoL Module DC DC Converter 1 Output 0.8 ~ 5.5V 1.2A 2.5V - 5.5V Input; DigiKey Part Number: 732-171010550CT-ND; Mouser Part Number: 710-171010550; ComponentLink1Description: DigiKey; ComponentLink1URL: https://www.digikey.com/en/products/detail/w%C3%BCrth-elektronik/171010550/10468263; ComponentLink2Description: Mouser; ComponentLink2URL: https://eu.mouser.com/ProductDetail/Wurth-Elektronik/171010550?qs=d0WKAl%252BL4KaovukkXP8RVA%3D%3D
R6000 R6002 R6005 R6008 = R000007: as R5007 on sheet 5V0_EXT_SUPPLY; ComponentLink1Description: DigiKey; ComponentLink1URL: https://www.digikey.com/en/products/detail/stackpole-electronics-inc/RMCF0603ZT0R00/1756908; resistance: 0 Ohm Jump; DigiKey Part Number: RMCF0603ZT0R00CT-ND
R6001 R6003 = R000011: as R3000 on sheet 5V_SYS_SUPPLY; ComponentLink1Description: DigiKey; ComponentLink1URL: https://www.digikey.com/en/products/detail/panasonic-electronic-components/ERJ-6GEY0R00V/78163; resistance: 0 Ohm Jump; DigiKey Part Number: P0.0ACT-ND
R6004 = R000006: as R3004 on sheet 5V_SYS_SUPPLY; resistance: 100kOhm; ComponentLink1Description: DigiKey; ComponentLink1URL: https://www.digikey.com/en/products/detail/stackpole-electronics-inc/RMCF0603FG100K/1713543; DigiKey Part Number: RMCF0603FG100KCT-ND
R6006 = R000004: as R4004 on sheet 3V3_SYS_SUPPLY; resistance: 1kOhm; ComponentLink1Description: DigiKey; ComponentLink1URL: https://www.digikey.com/en/products/detail/vishay-beyschlag-draloric-bc-components/MCT06030C1001FP500/2607821; DigiKey Part Number: MCT0603-1.00K-CFCT-ND
R6007 = R000014: 32.4 kOhms ±1% 0.1W, 1/10W Chip Resistor 0603 (1608 Metric) Moisture Resistant Thick Film; ComponentLink1Description: DigiKey; ComponentLink1URL: https://www.digikey.com/en/products/detail/bourns-inc/CR0603-FX-3242ELF/3783945; resistance: 32.4kOhm; DigiKey Part Number: CR0603-FX-3242ELFCT-ND
TP6000-TP6007 = TP002: Test point 1mm